# EAGLE design Project_Window_Control (EAGLE 9.0.0)
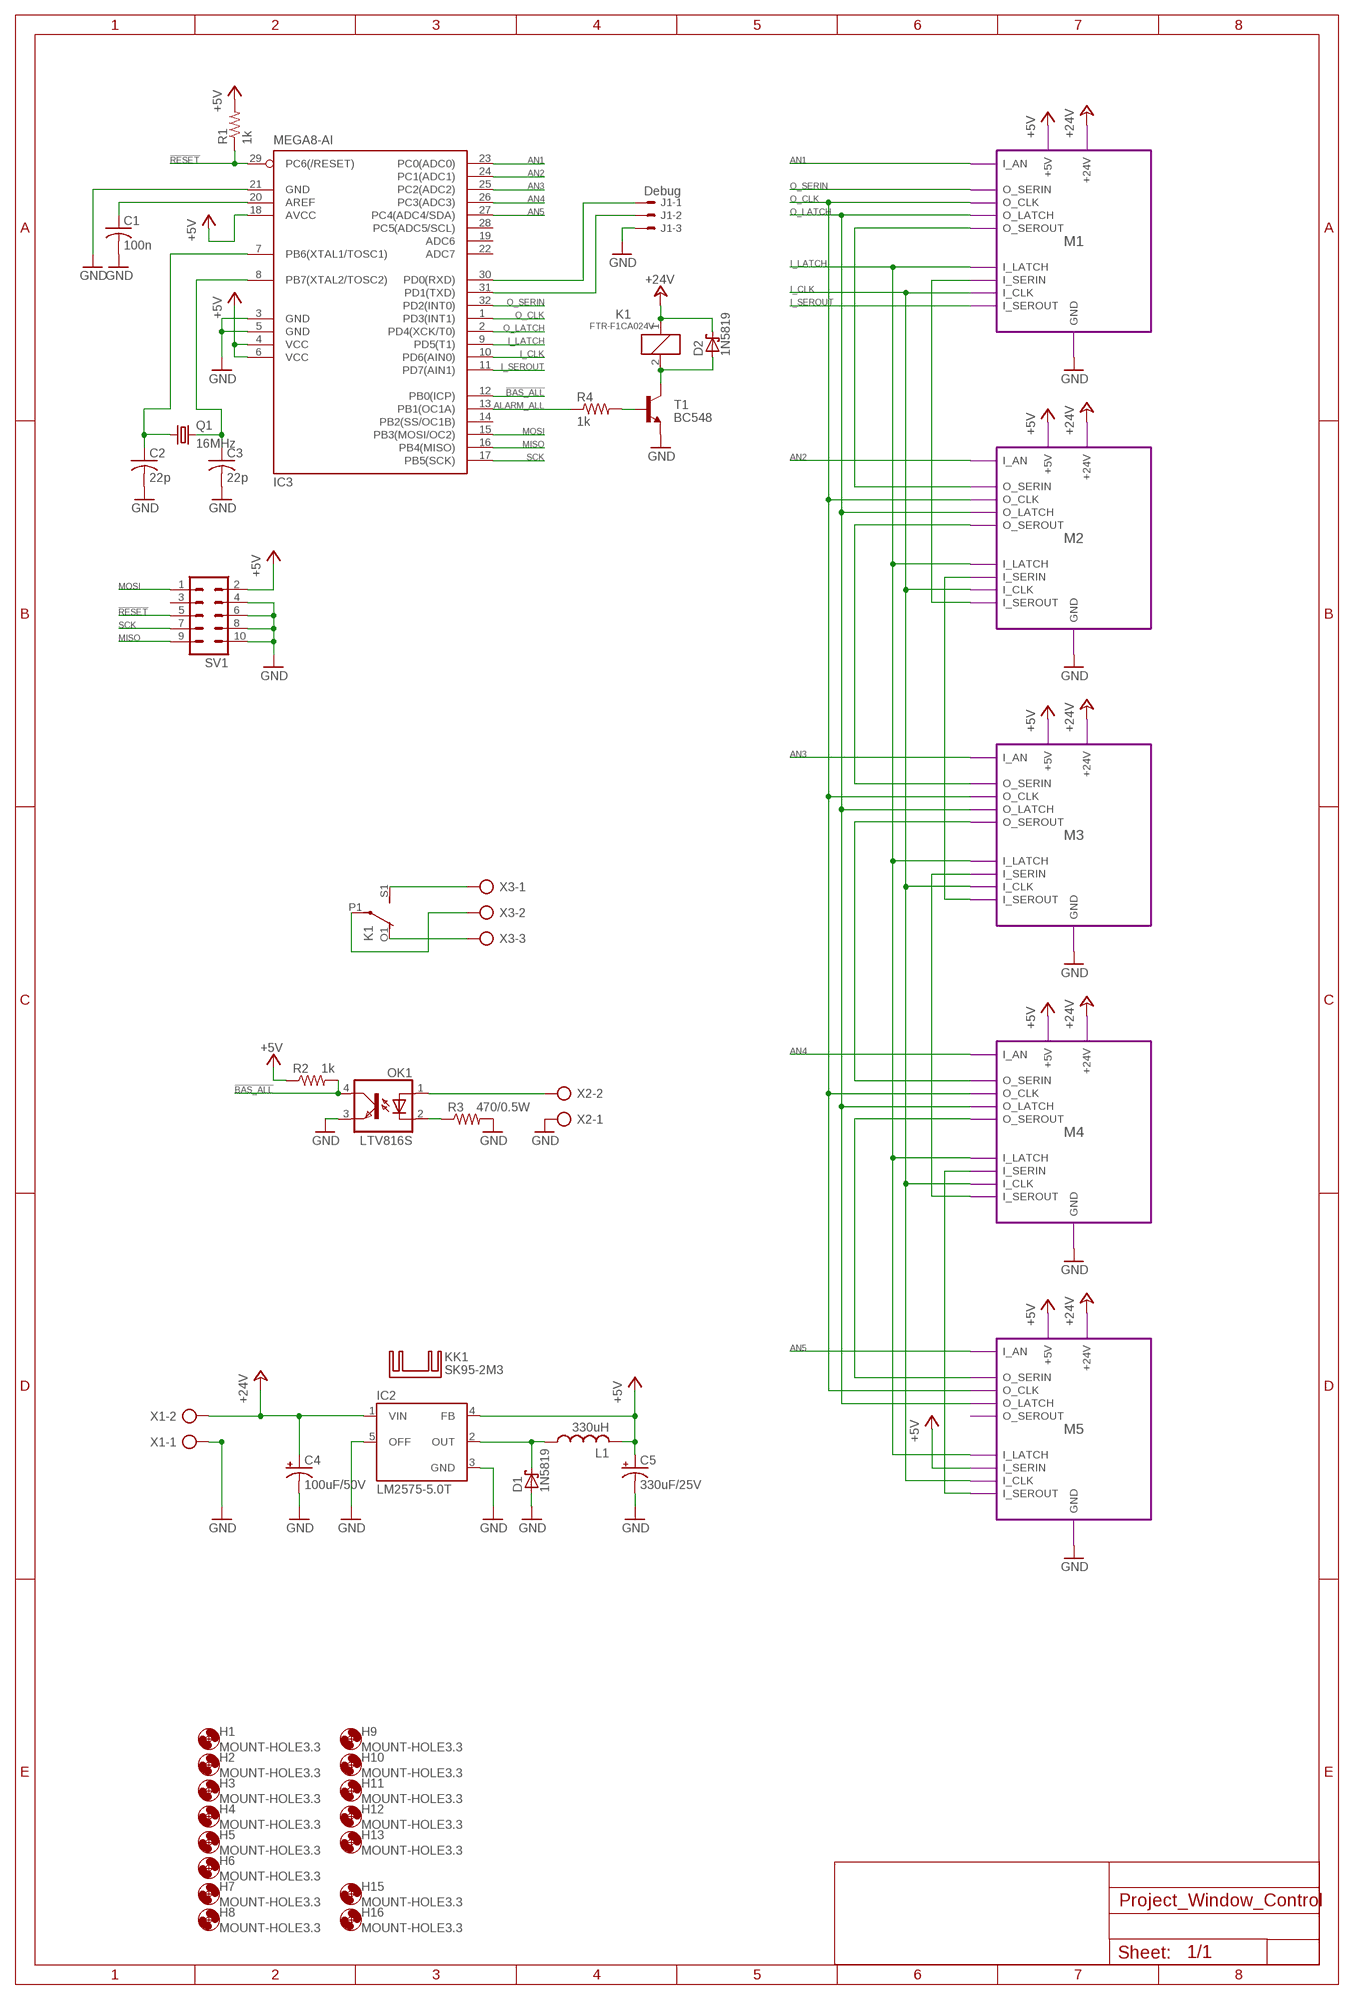
[diagram p0: schematic, sheet 1]

## Parts
C1  100n  C-US025_050-025X075  [C025_050-025X075]
C2  22p  C-US025-025X050  [C025-025X050]
C3  22p  C-US025-025X050  [C025-025X050]
C4  100uF/50V  CPOL-USE3.5-8  [E3,5-8]
C5  330uF/25V  CPOL-USE3.5-8  [E3,5-8]
D1  1N5819  SCHOTTKY-DIODEDO35-7  [DO35-7]
D2  1N5819  SCHOTTKY-DIODEDO35-7  [DO35-7]
H1  MOUNT-HOLE3.3  [3,3]
H2  MOUNT-HOLE3.3  [3,3]
H3  MOUNT-HOLE3.3  [3,3]
H4  MOUNT-HOLE3.3  [3,3]
H5  MOUNT-HOLE3.3  [3,3]
H6  MOUNT-HOLE3.3  [3,3]
H7  MOUNT-HOLE3.3  [3,3]
H8  MOUNT-HOLE3.3  [3,3]
H9  MOUNT-HOLE3.3  [3,3]
H10  MOUNT-HOLE3.3  [3,3]
H11  MOUNT-HOLE3.3  [3,3]
H12  MOUNT-HOLE3.3  [3,3]
H13  MOUNT-HOLE3.3  [3,3]
H15  MOUNT-HOLE3.3  [3,3]
H16  MOUNT-HOLE3.3  [3,3]
IC2  LM2575-5.0T  [TO220-5]
IC3  MEGA8-AI  [TQFP32-08]
J1  Debug  22-27-2031-03  [6410-03]
K1  FTR-F1CA024V  G2R2  [G2R2]
KK1  SK95-2M3  [SK95-2M3]
L1  330uH  L-US6000-XXX-RC  [6000-XXXX-RC]
OK1  LTV816S  [SMD4]
Q1  16MHz  CRYSTALHC49U-V  [HC49U-V]
R1  1k  R-US_R0805  [R0805]
R2  1k  R-US_R0805  [R0805]
R3  470/0.5W  R-US_0309/10  [0309/10]
R4  1k  R-US_R0805  [R0805]
SV1  ML10  [ML10]
T1  BC548  [TO92-EBC]
X1  AK500/2  [AK500/2]
X2  AK500/2  [AK500/2]
X3  AK500/3  [AK500/3]

## Module instances
M1 = M_CONTROL
M2 = M_CONTROL
M3 = M_CONTROL
M4 = M_CONTROL
M5 = M_CONTROL

## Nets
!BAS_ALL: IC3.12(PB0(ICP)) OK1.4(COL) R2.2
!RESET: IC3.29(PC6(/RESET)) R1.1 SV1.5
+5V: C5.+ IC2.4(FB) IC3.4(VCC) IC3.6(VCC) IC3.18(AVCC) L1.2 R1.2 R2.1 SV1.2 ; port M2.+5V M1.+5V M3.+5V M4.+5V M5.+5V M5.I_SERIN
+24V: C4.+ D2.C IC2.1(VIN) K1.1 X1.2 ; port M2.+24V M1.+24V M3.+24V M4.+24V M5.+24V
ALARM_ALL: IC3.13(PB1(OC1A)) R4.1
AN1: IC3.23(PC0(ADC0)) ; port M1.I_AN
AN2: IC3.24(PC1(ADC1)) ; port M2.I_AN
AN3: IC3.25(PC2(ADC2)) ; port M3.I_AN
AN4: IC3.26(PC3(ADC3)) ; port M4.I_AN
AN5: IC3.27(PC4(ADC4/SDA)) ; port M5.I_AN
BAS_ALL: OK1.1(A) X2.2
GND: C1.2 C2.2 C3.2 C4.- C5.- D1.A IC2.3(GND) IC2.5(OFF) IC3.3(GND) IC3.5(GND) IC3.21(GND) J1.3 OK1.3(EMIT) R3.2 SV1.4 SV1.6 SV1.8 SV1.10 T1.E X1.1 X2.1 ; port M1.GND M2.GND M3.GND M4.GND M5.GND
I_CLK: IC3.10(PD6(AIN0)) ; port M2.I_CLK M1.I_CLK M3.I_CLK M4.I_CLK M5.I_CLK
I_LATCH: IC3.9(PD5(T1)) ; port M1.I_LATCH M2.I_LATCH M3.I_LATCH M4.I_LATCH M5.I_LATCH
I_SEROUT: IC3.11(PD7(AIN1)) ; port M1.I_SEROUT
MISO: IC3.16(PB4(MISO)) SV1.9
MOSI: IC3.15(PB3(MOSI/OC2)) SV1.1
N$1: D2.A K1.2 T1.C
N$2: IC3.30(PD0(RXD)) J1.1
N$3: D1.C IC2.2(OUT) L1.1
N$4: R4.2 T1.B
N$5: OK1.2(C) R3.1
N$6: IC3.31(PD1(TXD)) J1.2
N$7: port M5.I_SEROUT M4.I_SERIN
N$8: port M1.O_SEROUT M2.O_SERIN
N$9: C3.1 IC3.8(PB7(XTAL2/TOSC2)) Q1.2
N$10: C2.1 IC3.7(PB6(XTAL1/TOSC1)) Q1.1
N$11: C1.1 IC3.20(AREF)
N$12: port M4.I_SEROUT M3.I_SERIN
N$13: port M3.I_SEROUT M2.I_SERIN
N$14: port M3.O_SERIN M2.O_SEROUT
N$15: port M2.I_SEROUT M1.I_SERIN
N$18: K1.S1(2:S) X3.1
N$20: port M4.O_SERIN M3.O_SEROUT
N$26: port M5.O_SERIN M4.O_SEROUT
N$40: K1.O1(2:O) X3.3
N$46: K1.P1(2:P) X3.2
O_CLK: IC3.1(PD3(INT1)) ; port M1.O_CLK M2.O_CLK M3.O_CLK M4.O_CLK M5.O_CLK
O_LATCH: IC3.2(PD4(XCK/T0)) ; port M1.O_LATCH M2.O_LATCH M3.O_LATCH M4.O_LATCH M5.O_LATCH
O_SERIN: IC3.32(PD2(INT0)) ; port M1.O_SERIN
SCK: IC3.17(PB5(SCK)) SV1.7
Unconnected: IC3.14(PB2(SS/OC1B)) IC3.19(ADC6) IC3.22(ADC7) IC3.28(PC5(ADC5/SCL)) K1.O2(3:O) K1.P2(3:P) K1.S2(3:S) SV1.3

## Library data of the parts
C1-C3 = rcl:C-US: CAPACITOR, American symbol
C4 C5 = rcl:CPOL-US: POLARIZED CAPACITOR, American symbol
D1 D2 = diode:SCHOTTKY-DIODE: Schottky Diode
H1-H13 H15 H16 = holes:MOUNT-HOLE: MOUNTING HOLE with drill center marker
IC2 = lm2575:LM2575-5.0: National Semiconductor <http://www.national.com> 1.0A "Simple Switcher"(c) 52kHz, Vout 1.23-37V (HV: 57V), Vin 40V (HV: 60V), 50µA standby current
IC3 = atmel:MEGA8: MICROCONTROLLER 8 Kbytes FLASH, 1 kbytes SRAM, 512 bytes EEPROM, USART, 6-channel 10 bit ADC, 2-channel 8 bit ADC Pin compatible with Atmega48, ATMega88, ATMega168 Source: avr.lbr; MPN: ATMEGA8-16AU; OC_FARNELL: 9171371; OC_NEWARK: 73M8863
J1 = con-molex:22-?-03: CONNECTOR wire to board 2.54 mm (.1 inch) pitch header; OC_FARNELL: unknown; OC_NEWARK: unknown
K1 = relay:G2R2: RELAY 2 x switch, Omron; MF: OMRON COMPONENTS USA; MPN: G2R-2-DC6; OC_FARNELL: unknown; OC_NEWARK: 89C5317
KK1 = heatsink:SK95-2M3: HEATSINK manufacturer Fischer/distributor Buerklin
L1 = rcl:L-US: INDUCTOR, American symbol
OK1 = optocoupler:LTV816: OPTO COUPLER Source: LITEON, LTV816.pdf; OC_FARNELL: unknown; OC_NEWARK: unknown
Q1 = crystal:CRYSTAL: CRYSTAL; OC_FARNELL: 1666969; OC_NEWARK: unknown
R1-R4 = rcl:R-US_: RESISTOR, American symbol
SV1 = con-ml:ML10: HARTING; OC_FARNELL: unknown; OC_NEWARK: unknown
T1 = transistor-npn:BC548*: NPN Transistor
X1 X2 = con-ptr500:AK500/2: CONNECTOR; OC_FARNELL: unknown; OC_NEWARK: unknown
X3 = con-ptr500:AK500/3: CONNECTOR; OC_FARNELL: unknown; OC_NEWARK: unknown

## Module M_CONTROL
Ports: I_AN(out) O_SERIN(in) O_CLK(in) O_LATCH(in) O_SEROUT(out) I_LATCH(in) I_SERIN(in) I_CLK(in) I_SEROUT(out) +5V(pwr) +24V(pwr) GND(pwr)
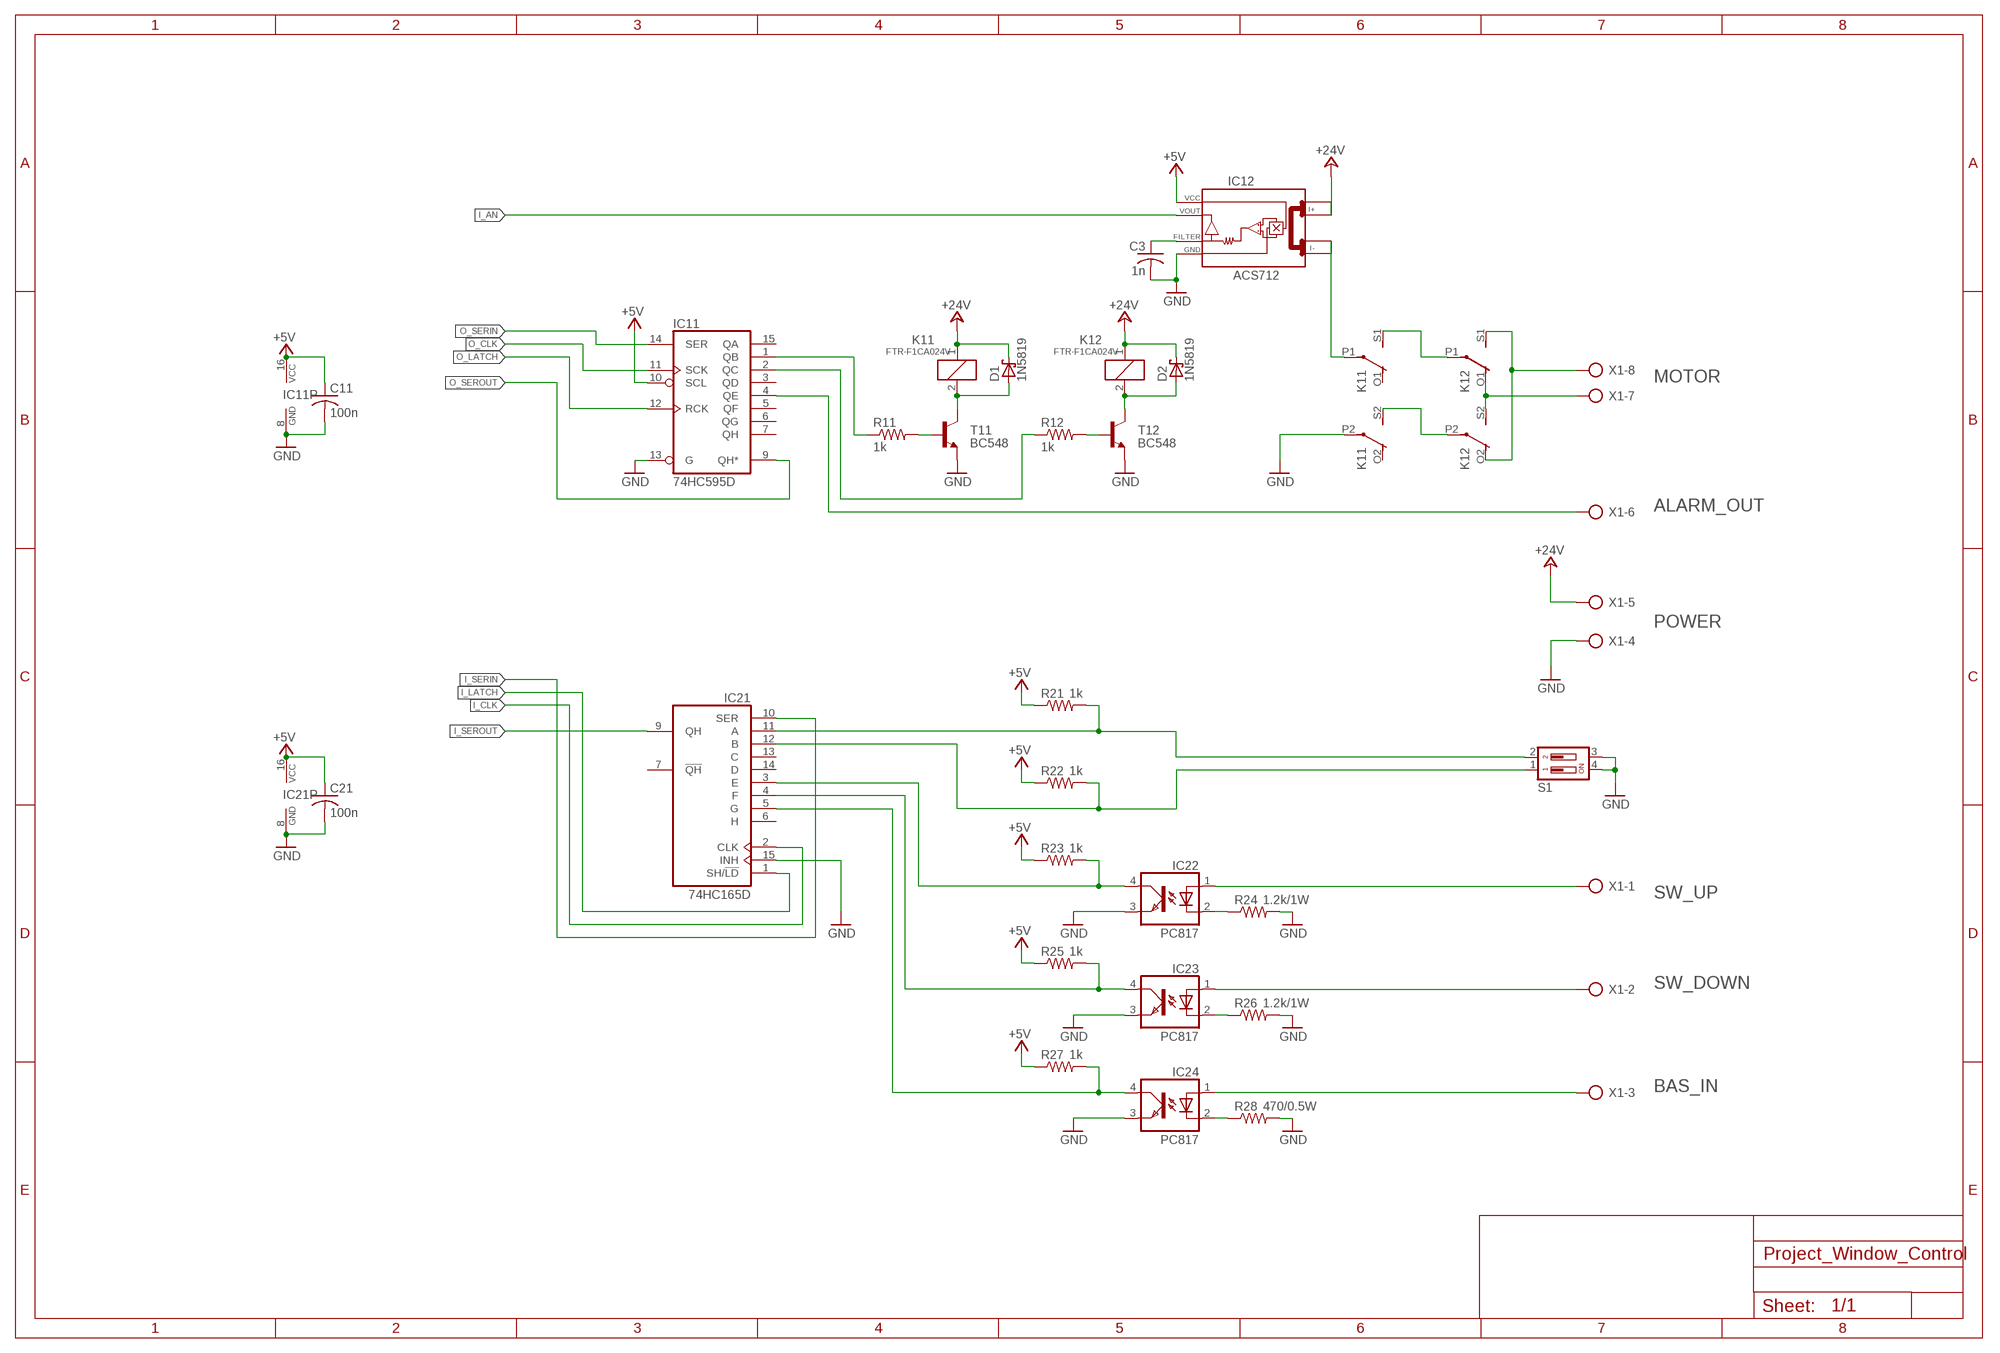
[diagram p1: schematic, module M_CONTROL, sheet 1]

### Parts
C3  1n  C-US025_050-025X075  [C025_050-025X075]
C11  100n  C-US025_050-025X075  [C025_050-025X075]
C21  100n  C-US025_050-025X075  [C025_050-025X075]
D1  1N5819  SCHOTTKY-DIODEDO35-7  [DO35-7]
D2  1N5819  SCHOTTKY-DIODEDO35-7  [DO35-7]
IC11  74HC595D  [SO16]
IC12  ACS712  [SO08]
IC21  74HC165D  [SO16]
IC22  PC817  LTV816S  [SMD4]
IC23  PC817  LTV816S  [SMD4]
IC24  PC817  LTV816S  [SMD4]
K11  FTR-F1CA024V  G2R2  [G2R2]
K12  FTR-F1CA024V  G2R2  [G2R2]
R11  1k  R-US_R0805  [R0805]
R12  1k  R-US_R0805  [R0805]
R21  1k  R-US_R0805  [R0805]
R22  1k  R-US_R0805  [R0805]
R23  1k  R-US_R0805  [R0805]
R24  1.2k/1W  R-US_0309/10  [0309/10]
R25  1k  R-US_R0805  [R0805]
R26  1.2k/1W  R-US_0309/10  [0309/10]
R27  1k  R-US_R0805  [R0805]
R28  470/0.5W  R-US_0309/10  [0309/10]
S1  DS02  [DS-02]
T11  BC548  [TO92-EBC]
T12  BC548  [TO92-EBC]
X1  AK500/8  [AK500/8]

### Nets
+5V: C11.1 C21.1 IC11.10(SCL) IC11.16(VCC) IC12.8(VCC) IC21.16(VCC) R21.1 R22.1 R23.1 R25.1 R27.1
+24V: D1.C D2.C IC12.1(I+_0) IC12.2(I+_1) K11.1 K12.1 X1.5
ALARM: IC11.4(QE) X1.6
BAS: IC24.1(A) X1.3
GND: C3.2 C11.2 C21.2 IC11.8(GND) IC11.13(G) IC12.5(GND) IC21.8(GND) IC21.15(INH) IC22.3(EMIT) IC23.3(EMIT) IC24.3(EMIT) K11.P2(3:P) R24.2 R26.2 R28.2 S1.3 S1.4 T11.E T12.E X1.4
I_AN: IC12.7(VOUT)
I_CLK: IC21.2(CLK)
I_LATCH: IC21.1(SH/!LD)
I_SERIN: IC21.10(SER)
I_SEROUT: IC21.9(QH)
MOTOR_A: K12.O2(3:O) K12.S1(2:S) X1.8
MOTOR_B: K12.O1(2:O) K12.S2(3:S) X1.7
N$1: K11.S1(2:S) K12.P1(2:P)
N$2: K11.S2(3:S) K12.P2(3:P)
N$3: D1.A K11.2 T11.C
N$4: R11.2 T11.B
N$5: IC22.2(C) R24.1
N$6: IC12.3(I-_0) IC12.4(I-_1) K11.P1(2:P)
N$7: D2.A K12.2 T12.C
N$8: R12.2 T12.B
N$9: C3.1 IC12.6(FILTER)
N$10: IC21.5(G) IC24.4(COL) R27.2
N$11: IC21.3(E) IC22.4(COL) R23.2
N$12: IC11.1(QB) R11.1
N$13: IC11.2(QC) R12.1
N$15: IC21.4(F) IC23.4(COL) R25.2
N$16: IC23.2(C) R26.1
N$17: IC24.2(C) R28.1
O_CLK: IC11.11(SCK)
O_LATCH: IC11.12(RCK)
O_SERIN: IC11.14(SER)
O_SEROUT: IC11.9(QH*)
S_DOWN: IC23.1(A) X1.2
S_SETTING: IC21.11(A) R21.2 S1.2
S_SETTING1: IC21.12(B) R22.2 S1.1
S_UP: IC22.1(A) X1.1
Unconnected: IC11.3(QD) IC11.5(QF) IC11.6(QG) IC11.7(QH) IC11.15(QA) IC21.6(H) IC21.7(!QH) IC21.13(C) IC21.14(D) K11.O1(2:O) K11.O2(3:O)

### Notes on the sheet
- MOTOR
- ALARM_OUT
- POWER
- SW_UP
- SW_DOWN
- BAS_IN

### Library data of the parts
C3 C11 C21 = rcl:C-US: CAPACITOR, American symbol
D1 D2 = diode:SCHOTTKY-DIODE: Schottky Diode
IC11 = 74xx-eu:74*595: 8-bit SHIFT REGISTER, output latch
IC12 = ACS712:ACS712
IC21 = 74xx-eu:74*165: 8-bit parallel load SHIFT REGISTER
IC22-IC24 = optocoupler:LTV816: OPTO COUPLER Source: LITEON, LTV816.pdf; OC_FARNELL: unknown; OC_NEWARK: unknown
K11 K12 = relay:G2R2: RELAY 2 x switch, Omron; MF: OMRON COMPONENTS USA; MPN: G2R-2-DC6; OC_FARNELL: unknown; OC_NEWARK: 89C5317
R11 = rcl:R-US_: RESISTOR, American symbol; SPICEPREFIX: R
R12 R21-R28 = rcl:R-US_: RESISTOR, American symbol
S1 = switch-dil:DS02: DIL/CODE SWITCH; OC_FARNELL: 9472126; OC_NEWARK: unknown
T11 T12 = transistor-npn:BC548*: NPN Transistor
X1 = con-ptr500:AK500/8: CONNECTOR; OC_FARNELL: unknown; OC_NEWARK: unknown

## Board
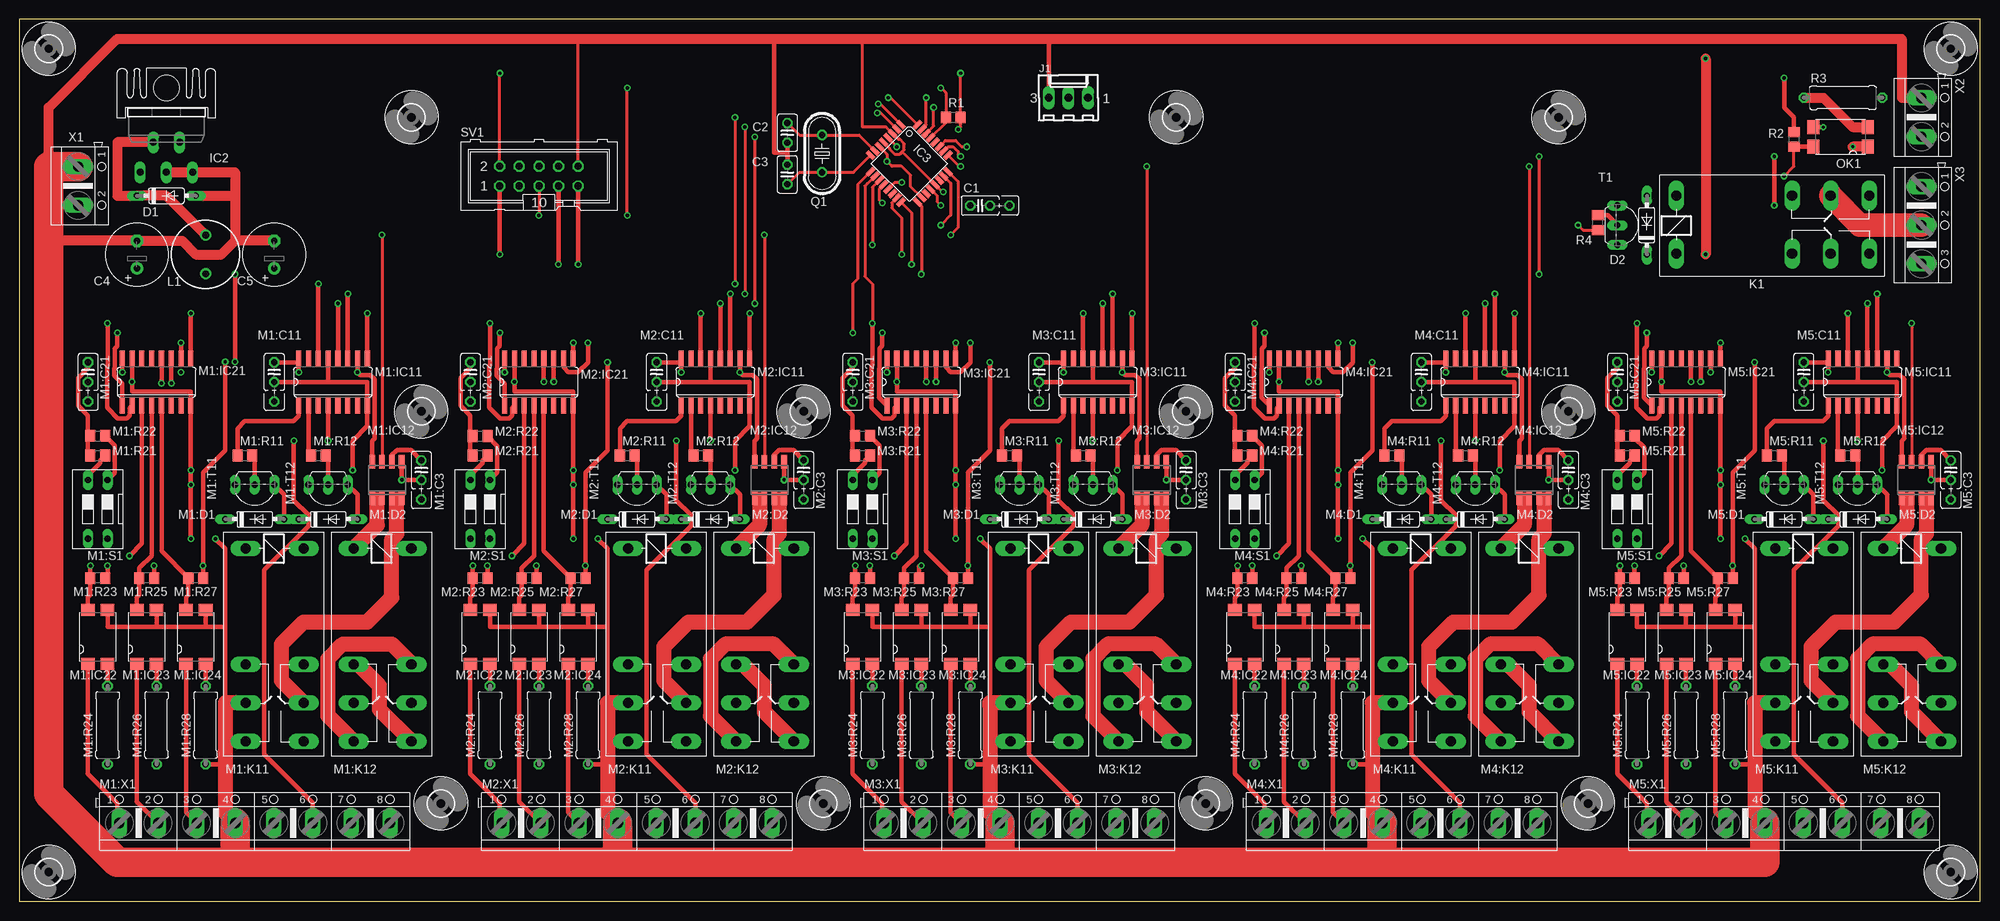
[diagram p2: board, top side]
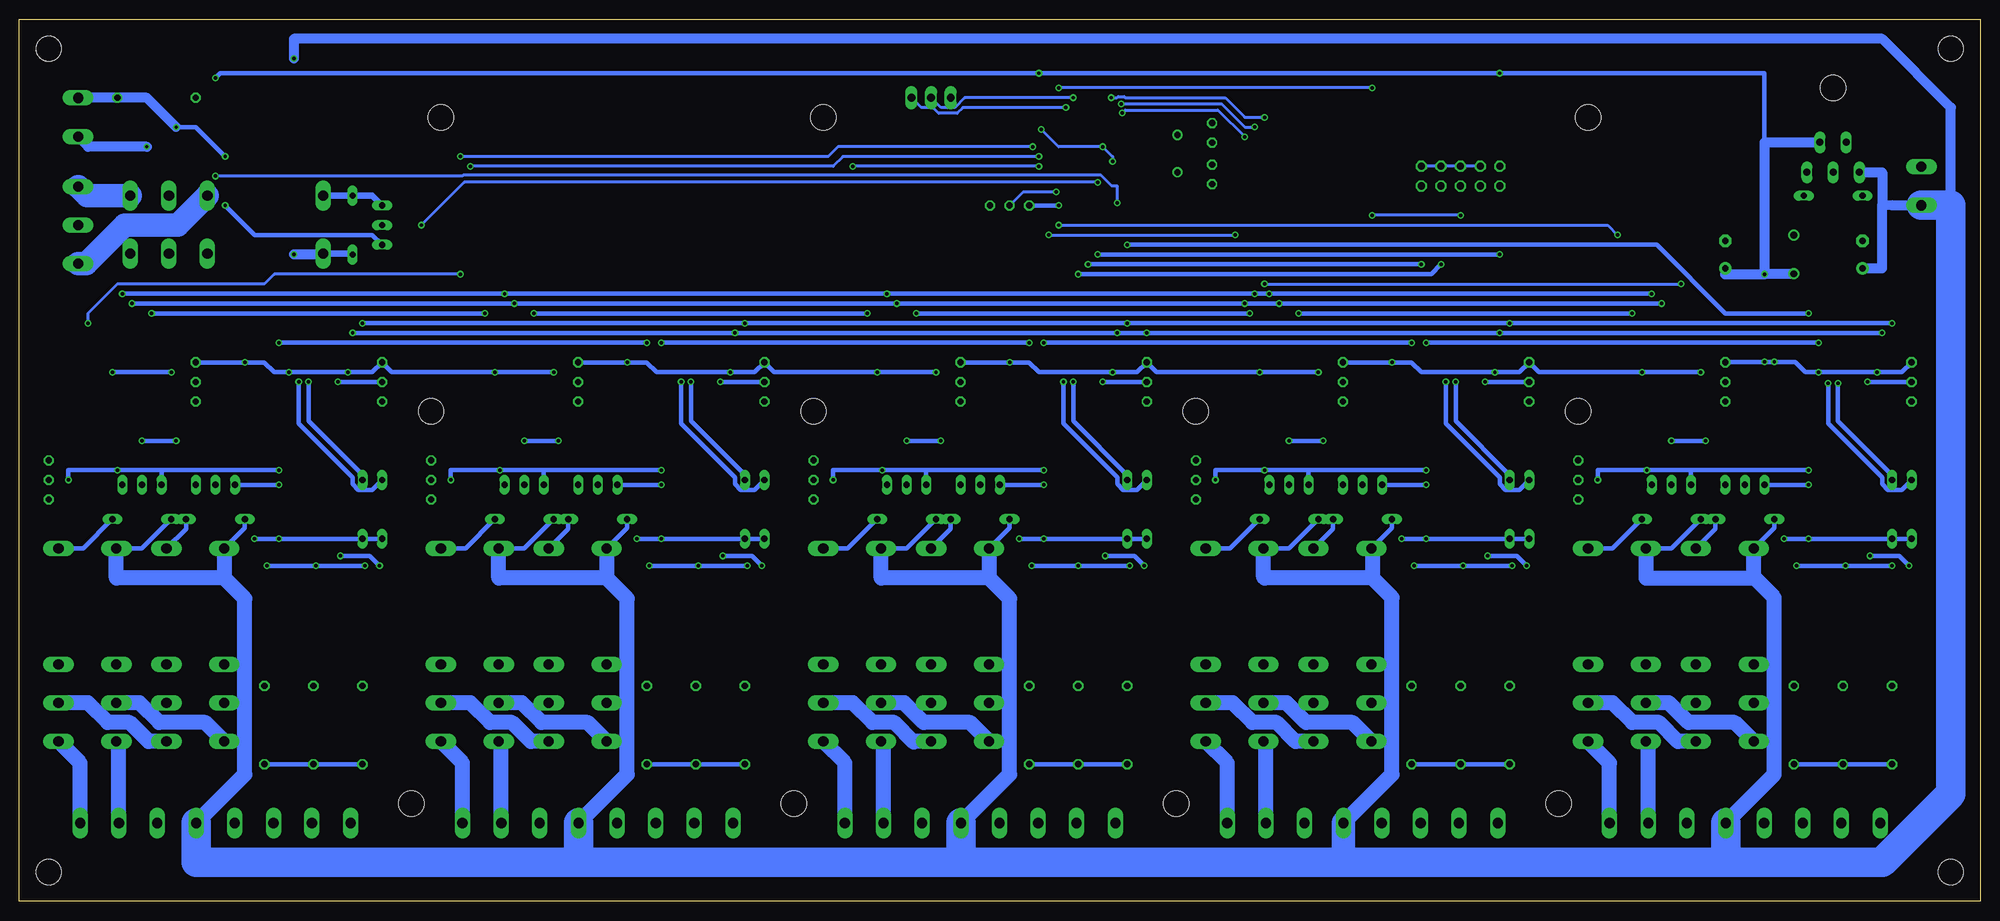
[diagram p3: board, bottom side, seen from below]

Size 254 x 114.3 mm. Coordinates in mm from the lower left corner, seen from the top.
Outline: 0,0 254,0 254,114.3 0,114.29 0,0
Copper layers (1*16): Top 0.035mm / dielectric 1.5mm / Bottom 0.035mm
Design rules "default *": minimum track width 6mil, minimum drill 0.35mm, track to track 12.5mil, track to pad 12.5mil, pad to pad 12.5mil, via to via 12.5mil, smd to smd 10mil, copper to edge 40mil, drill to drill 6mil, minimum pad ring 10mil, minimum via ring 8mil, stop-mask expansion 4mil, vias tented up to drill 0mil, thermal gap 10mil

### Footprints (pad centres in the part's own frame; a part is rotated, then mirrored left to right if it is on the bottom)
C025_050-025X075 = drill 0.813 octagon: 1 -1.27,0; 2 1.27,0; 3 3.81,0
C025-025X050 = drill 0.813 octagon: 1 -1.27,0; 2 1.27,0
E3,5-8 = drill 0.813 pad 1.6: + -1.778,0 | drill 0.813 pad 1.6 octagon: - 1.778,0
DO35-7 = drill 0.813 long: A 3.81,0; C -3.81,0
3,3 = hole 3.3: 0,0
TO220-5 = drill 0.9 long: 1 -3.4,-8.4; 2 -1.7,-4.5; 3 0,-8.4; 4 1.7,-4.5; 5 3.4,-8.4
TQFP32-08 = smd 1.27 x 0.559: 1 -4.293,2.8; 2 -4.293,2; 3 -4.293,1.2; 4 -4.293,0.4; 5 -4.293,-0.4; 6 -4.293,-1.2; 7 -4.293,-2; 8 -4.293,-2.8; 17 4.293,-2.8; 18 4.293,-2; 19 4.293,-1.2; 20 4.293,-0.4; 21 4.293,0.4; 22 4.293,1.2; 23 4.293,2; 24 4.293,2.8 | smd 0.559 x 1.27: 9 -2.8,-4.293; 10 -2,-4.293; 11 -1.2,-4.293; 12 -0.4,-4.293; 13 0.4,-4.293; 14 1.2,-4.293; 15 2,-4.293; 16 2.8,-4.293; 25 2.8,4.293; 26 2,4.293; 27 1.2,4.293; 28 0.4,4.293; 29 -0.4,4.293; 30 -1.2,4.293; 31 -2,4.293; 32 -2.8,4.293
6410-03 = drill 1.016 long: 1 2.54,0; 2 0,0; 3 -2.54,0
G2R2 = drill 1.321 long: 1 -2.54,-3.683; 2 -2.54,3.81; O1 12.471,3.81; O2 12.471,-3.683; P1 17.45,3.81; P2 17.45,-3.683; S1 22.454,3.81; S2 22.454,-3.683
SK95-2M3 = hole 3.302: 0,2.54
6000-XXXX-RC = drill 0.9 pad 1.422: 1 -2.5,0; 2 2.5,0
SO16 = smd 0.66 x 2.032: 1 -4.445,-3.073; 2 -3.175,-3.073; 3 -1.905,-3.073; 4 -0.635,-3.073; 5 0.635,-3.073; 6 1.905,-3.073; 7 3.175,-3.073; 8 4.445,-3.073; 9 4.445,3.073; 10 3.175,3.073; 11 1.905,3.073; 12 0.635,3.073; 13 -0.635,3.073; 14 -1.905,3.073; 15 -3.175,3.073; 16 -4.445,3.073
SO08 = smd 0.72 x 1.78: 1 -1.905,-2.35; 2 -0.635,-2.35; 3 0.635,-2.35; 4 1.905,-2.35; 5 1.905,2.35; 6 0.635,2.35; 7 -0.635,2.35; 8 -1.905,2.35
SMD4 = smd 1.78 x 1.55: 1 -1.27,-3.5; 2 1.27,-3.5; 3 1.27,3.5; 4 -1.27,3.5
R0805 = smd 1.3 x 1.5: 1 -0.95,0; 2 0.95,0
0309/10 = drill 0.813 octagon: 1 -5.08,0; 2 5.08,0
DS-02 = drill 0.813 long: 1 -1.27,-3.81; 2 1.27,-3.81; 3 1.27,3.81; 4 -1.27,3.81
TO92-EBC = drill 0.813 long: B 0,-1.27; C -2.54,-1.27; E 2.54,-1.27
AK500/8 = drill 1.321 long: 1 -17.526,0; 2 -12.497,0; 3 -7.518,0; 4 -2.489,0; 5 2.489,0; 6 7.518,0; 7 12.497,0; 8 17.526,0
HC49U-V = drill 0.813: 1 -2.413,0; 2 2.413,0
ML10 = drill 0.914 octagon: 1 -5.08,-1.27; 2 -5.08,1.27; 3 -2.54,-1.27; 4 -2.54,1.27; 5 0,-1.27; 6 0,1.27; 7 2.54,-1.27; 8 2.54,1.27; 9 5.08,-1.27; 10 5.08,1.27
AK500/2 = drill 1.321 long: 1 -2.515,0; 2 2.515,0
AK500/3 = drill 1.321 long: 1 -5.004,0; 2 0,0; 3 5.004,0

### Placement (x,y rotation side)
C1  124.46,90.17 0 top
C2  99.5,99.59 270 top
C3  99.5,94.2 90 top
C4  15.24,83.82 90 top
C5  33.02,83.82 90 top
D1  19.05,91.44 0 top
D2  210.82,87.63 90 top
H1  3.81,3.81 0 top
H2  250.19,3.81 0 top
H3  250.19,110.49 0 top
H4  3.81,110.49 0 top
H5  54.61,12.7 0 top
H6  104.14,12.7 0 top
H7  153.67,12.7 0 top
H8  203.2,12.7 0 top
H9  52.07,63.5 0 top
H10  101.6,63.5 0 top
H11  151.13,63.5 0 top
H12  200.66,63.5 0 top
H13  50.8,101.6 0 top
H15  149.86,101.6 0 top
H16  199.39,101.6 0 top
IC2  19.05,102.87 0 top
IC3  115.29,95.62 315 top
J1  135.89,104.14 0 top
K1  217.17,87.63 0 top
KK1  19.05,102.87 0 top
L1  24.13,83.82 270 top
M1:C3  1n  [C025_050-025X075]  52.07,55.88 270 top
M1:C11  100n  [C025_050-025X075]  33.02,68.58 270 top
M1:C21  100n  [C025_050-025X075]  8.89,68.58 270 top
M1:D1  1N5819  [DO35-7]  30.48,49.53 0 top
M1:D2  1N5819  [DO35-7]  40.01,49.53 0 top
M1:IC11  74HC595D  [SO16]  40.64,67.31 0 top
M1:IC12  ACS712  [SO08]  47.62,54.61 0 top
M1:IC21  74HC165D  [SO16]  17.78,67.31 0 top
M1:IC22  PC817  [SMD4]  10.16,34.29 0 top
M1:IC23  PC817  [SMD4]  16.51,34.29 0 top
M1:IC24  PC817  [SMD4]  22.86,34.29 0 top
M1:K11  FTR-F1CA024V  [G2R2]  33.02,43.18 270 top
M1:K12  FTR-F1CA024V  [G2R2]  46.99,43.18 270 top
M1:R11  1k  [R0805]  29.21,57.78 0 top
M1:R12  1k  [R0805]  38.73,57.78 0 top
M1:R21  1k  [R0805]  10.16,57.78 0 top
M1:R22  1k  [R0805]  10.16,60.33 0 top
M1:R23  1k  [R0805]  10.16,41.91 180 top
M1:R24  1.2k/1W  [0309/10]  11.43,22.86 270 top
M1:R25  1k  [R0805]  16.51,41.91 180 top
M1:R26  1.2k/1W  [0309/10]  17.78,22.86 270 top
M1:R27  1k  [R0805]  22.86,41.91 180 top
M1:R28  470/0.5W  [0309/10]  24.13,22.86 270 top
M1:S1  [DS-02]  10.16,50.8 180 top
M1:T11  BC548  [TO92-EBC]  30.48,52.7 180 top
M1:T12  BC548  [TO92-EBC]  40.01,52.7 180 top
M1:X1  [AK500/8]  30.48,10.16 0 top
M2:C3  1n  [C025_050-025X075]  101.6,55.88 270 top
M2:C11  100n  [C025_050-025X075]  82.55,68.58 270 top
M2:C21  100n  [C025_050-025X075]  58.42,68.58 270 top
M2:D1  1N5819  [DO35-7]  80.01,49.53 0 top
M2:D2  1N5819  [DO35-7]  89.53,49.53 0 top
M2:IC11  74HC595D  [SO16]  90.17,67.31 0 top
M2:IC12  ACS712  [SO08]  97.16,54.61 0 top
M2:IC21  74HC165D  [SO16]  67.31,67.31 0 top
M2:IC22  PC817  [SMD4]  59.69,34.28 0 top
M2:IC23  PC817  [SMD4]  66.04,34.29 0 top
M2:IC24  PC817  [SMD4]  72.39,34.29 0 top
M2:K11  FTR-F1CA024V  [G2R2]  82.55,43.18 270 top
M2:K12  FTR-F1CA024V  [G2R2]  96.52,43.18 270 top
M2:R11  1k  [R0805]  78.74,57.78 0 top
M2:R12  1k  [R0805]  88.27,57.78 0 top
M2:R21  1k  [R0805]  59.69,57.78 0 top
M2:R22  1k  [R0805]  59.69,60.3 0 top
M2:R23  1k  [R0805]  59.69,41.91 180 top
M2:R24  1.2k/1W  [0309/10]  60.96,22.86 270 top
M2:R25  1k  [R0805]  66.04,41.91 180 top
M2:R26  1.2k/1W  [0309/10]  67.31,22.86 270 top
M2:R27  1k  [R0805]  72.39,41.91 180 top
M2:R28  470/0.5W  [0309/10]  73.66,22.86 270 top
M2:S1  [DS-02]  59.69,50.8 180 top
M2:T11  BC548  [TO92-EBC]  80.01,52.7 180 top
M2:T12  BC548  [TO92-EBC]  89.53,52.7 180 top
M2:X1  [AK500/8]  80.01,10.16 0 top
M3:C3  1n  [C025_050-025X075]  151.13,55.88 270 top
M3:C11  100n  [C025_050-025X075]  132.08,68.58 270 top
M3:C21  100n  [C025_050-025X075]  107.95,68.58 270 top
M3:D1  1N5819  [DO35-7]  129.54,49.53 0 top
M3:D2  1N5819  [DO35-7]  139.06,49.53 0 top
M3:IC11  74HC595D  [SO16]  139.7,67.31 0 top
M3:IC12  ACS712  [SO08]  146.69,54.61 0 top
M3:IC21  74HC165D  [SO16]  116.84,67.31 0 top
M3:IC22  PC817  [SMD4]  109.22,34.29 0 top
M3:IC23  PC817  [SMD4]  115.57,34.29 0 top
M3:IC24  PC817  [SMD4]  121.92,34.29 0 top
M3:K11  FTR-F1CA024V  [G2R2]  132.08,43.18 270 top
M3:K12  FTR-F1CA024V  [G2R2]  146.05,43.18 270 top
M3:R11  1k  [R0805]  128.27,57.78 0 top
M3:R12  1k  [R0805]  137.79,57.78 0 top
M3:R21  1k  [R0805]  109.22,57.78 0 top
M3:R22  1k  [R0805]  109.22,60.33 0 top
M3:R23  1k  [R0805]  109.22,41.91 180 top
M3:R24  1.2k/1W  [0309/10]  110.49,22.86 270 top
M3:R25  1k  [R0805]  115.57,41.91 180 top
M3:R26  1.2k/1W  [0309/10]  116.84,22.86 270 top
M3:R27  1k  [R0805]  121.92,41.91 180 top
M3:R28  470/0.5W  [0309/10]  123.19,22.86 270 top
M3:S1  [DS-02]  109.22,50.8 180 top
M3:T11  BC548  [TO92-EBC]  129.54,52.7 180 top
M3:T12  BC548  [TO92-EBC]  139.06,52.7 180 top
M3:X1  [AK500/8]  129.54,10.16 0 top
M4:C3  1n  [C025_050-025X075]  200.66,55.88 270 top
M4:C11  100n  [C025_050-025X075]  181.61,68.58 270 top
M4:C21  100n  [C025_050-025X075]  157.48,68.58 270 top
M4:D1  1N5819  [DO35-7]  179.07,49.53 0 top
M4:D2  1N5819  [DO35-7]  188.59,49.53 0 top
M4:IC11  74HC595D  [SO16]  189.23,67.31 0 top
M4:IC12  ACS712  [SO08]  196.22,54.61 0 top
M4:IC21  74HC165D  [SO16]  166.37,67.31 0 top
M4:IC22  PC817  [SMD4]  158.75,34.29 0 top
M4:IC23  PC817  [SMD4]  165.1,34.29 0 top
M4:IC24  PC817  [SMD4]  171.45,34.29 0 top
M4:K11  FTR-F1CA024V  [G2R2]  181.61,43.18 270 top
M4:K12  FTR-F1CA024V  [G2R2]  195.58,43.18 270 top
M4:R11  1k  [R0805]  177.8,57.78 0 top
M4:R12  1k  [R0805]  187.32,57.78 0 top
M4:R21  1k  [R0805]  158.75,57.78 0 top
M4:R22  1k  [R0805]  158.75,60.33 0 top
M4:R23  1k  [R0805]  158.75,41.91 180 top
M4:R24  1.2k/1W  [0309/10]  160.02,22.86 270 top
M4:R25  1k  [R0805]  165.1,41.91 180 top
M4:R26  1.2k/1W  [0309/10]  166.37,22.86 270 top
M4:R27  1k  [R0805]  171.45,41.91 180 top
M4:R28  470/0.5W  [0309/10]  172.72,22.86 270 top
M4:S1  [DS-02]  158.75,50.8 180 top
M4:T11  BC548  [TO92-EBC]  179.07,52.7 180 top
M4:T12  BC548  [TO92-EBC]  188.59,52.7 180 top
M4:X1  [AK500/8]  179.07,10.16 0 top
M5:C3  1n  [C025_050-025X075]  250.19,55.88 270 top
M5:C11  100n  [C025_050-025X075]  231.14,68.58 270 top
M5:C21  100n  [C025_050-025X075]  207.01,68.58 270 top
M5:D1  1N5819  [DO35-7]  228.6,49.53 0 top
M5:D2  1N5819  [DO35-7]  238.12,49.53 0 top
M5:IC11  74HC595D  [SO16]  238.76,67.31 0 top
M5:IC12  ACS712  [SO08]  245.75,54.61 0 top
M5:IC21  74HC165D  [SO16]  215.9,67.31 0 top
M5:IC22  PC817  [SMD4]  208.28,34.29 0 top
M5:IC23  PC817  [SMD4]  214.63,34.29 0 top
M5:IC24  PC817  [SMD4]  220.98,34.29 0 top
M5:K11  FTR-F1CA024V  [G2R2]  231.14,43.18 270 top
M5:K12  FTR-F1CA024V  [G2R2]  245.11,43.18 270 top
M5:R11  1k  [R0805]  227.33,57.78 0 top
M5:R12  1k  [R0805]  236.85,57.78 0 top
M5:R21  1k  [R0805]  208.28,57.78 0 top
M5:R22  1k  [R0805]  208.28,60.33 0 top
M5:R23  1k  [R0805]  208.28,41.91 180 top
M5:R24  1.2k/1W  [0309/10]  209.55,22.86 270 top
M5:R25  1k  [R0805]  214.63,41.91 180 top
M5:R26  1.2k/1W  [0309/10]  215.9,22.86 270 top
M5:R27  1k  [R0805]  220.98,41.91 180 top
M5:R28  470/0.5W  [0309/10]  222.25,22.86 270 top
M5:S1  [DS-02]  208.28,50.8 180 top
M5:T11  BC548  [TO92-EBC]  228.6,52.7 180 top
M5:T12  BC548  [TO92-EBC]  238.12,52.7 180 top
M5:X1  [AK500/8]  228.6,10.16 0 top
OK1  235.91,99.06 90 top
Q1  103.99,96.89 270 top
R1  120.97,101.6 0 top
R2  229.87,98.74 270 top
R3  236.22,104.14 0 top
R4  204.47,87.95 90 top
SV1  67.31,93.98 0 top
T1  208.28,87.63 270 top
X1  7.62,92.71 270 top
X2  246.38,101.6 270 top
X3  246.38,87.63 270 top

### Tracks (layer width: path | path; a pad name or v marks a point on that pad's centre or on a via)
!BAS_ALL  (via drill 0.45)
  Top 0.406: IC3.12 111.44,92.34 111.44,90.81 v111.76,90.49 | v228.6,93.98 229.87,95.25 R2.2
  Top 0.61: R2.2 OK1.4
  Bottom 0.406: v111.76,90.49 111.76,92.71 112.48,92.71 113.91,94.14 196.45,94.14 196.6,93.98 v228.6,93.98
!RESET  (via drill 0.45)
  Top 0.406: SV1.5 v67.31,88.9 | v78.74,88.9 v78.74,105.41 | v119.38,105.41 120.02,104.77 R1.1 120.02,100.92 IC3.29
  Bottom 0.406: v78.74,105.41 v119.38,105.41 | v67.31,88.9 v78.74,88.9
+5V  (via drill 0.45)
  Top 0.406: IC3.4 113.67,97.81 v113.67,97.79 | IC3.6 112.39,96.82 v112.39,95.89 113.03,95.25 114.3,95.25 115.47,94.08 115.47,92.61 IC3.18 | SV1.2 v62.23,107.31 | v121.92,107.31 R1.2 121.92,100.65 121.92,100.33 v121.6,100.01
  Top 0.61: M1:R23.1 11.43,42.23 v11.43,43.5 | v17.46,43.5 M1:R25.1 | M1:R27.1 v23.81,43.49 v23.81,43.5 23.81,55.56 26.67,58.42 v26.67,69.91 | M1:IC11.10 v43.81,68.58 44.16,68.24 45.47,68.24 46.04,67.67 46.04,59.97 45.72,59.65 M1:IC12.8 | v36.2,68.58 M1:IC11.16 36.2,69.85 M1:C11.1 | M2:R27.1 v73.34,43.49 v73.34,43.5 73.34,55.56 76.2,58.42 v76.2,69.85 | v60.64,43.5 M2:R23.1 | M2:R25.1 v66.99,43.49 v66.99,43.5 | M3:R27.1 v122.87,43.49 v122.87,43.5 122.87,55.56 125.73,58.42 v125.73,69.85 | v110.17,43.5 v110.17,43.49 M3:R23.1 | M3:R25.1 116.52,43.5 v116.84,43.5 | M4:R27.1 v172.4,43.49 v172.4,43.5 172.4,55.56 175.26,58.42 v175.26,69.85 | v159.7,43.5 v159.7,43.49 M4:R23.1 | M4:R25.1 v166.05,43.49 v166.05,43.5 | M5:R27.1 v221.93,43.49 v221.93,43.5 221.93,55.56 224.79,58.42 v224.79,69.85 | v209.23,43.5 M5:R23.1 | M5:R25.1 v215.58,43.49 v215.58,43.5 | 62.87,70.48 M2:IC21.16 v62.87,68.58 | 85.72,70.48 M2:IC11.16 | 112.39,70.48 M3:IC21.16 v112.39,68.58 | 135.25,70.48 M3:IC11.16 | 161.93,70.48 M4:IC21.16 v161.93,68.58 | 184.78,70.48 M4:IC11.16 | 211.46,70.48 M5:IC21.16 v211.46,68.58 | 234.31,70.48 M5:IC11.16 | M2:R21.1 58.42,57.78 58.42,60.96 | M3:R21.1 107.95,57.78 107.95,59.69 | M1:R21.1 8.89,57.78 8.89,59.69 | M4:R21.1 157.48,57.78 157.48,59.69 | M5:R21.1 207.01,57.78 207.01,60.96 | M2:IC11.16 v85.72,68.58 | M2:IC11.10 v93.34,68.58 93.69,68.24 95,68.24 95.57,67.67 95.57,59.97 95.25,59.65 M2:IC12.8 | M3:IC11.16 v135.25,68.58 | M3:IC11.10 v142.88,68.58 143.22,68.24 144.53,68.24 145.1,67.67 145.1,59.97 144.78,59.65 M3:IC12.8 | M4:IC11.16 v184.78,68.58 | M4:IC11.10 v192.41,68.58 192.75,68.24 194.06,68.24 194.63,67.67 194.63,59.97 194.31,59.65 M4:IC12.8
  Top 0.61: M5:IC11.10 v241.94,68.58 242.28,68.24 243.59,68.24 244.16,67.67 244.16,59.97 243.84,59.65 M5:IC12.8 | M1:R22.1 9.21,60.01 8.89,59.69 | M2:R22.1 58.74,60.64 58.42,60.96 | M3:R22.1 108.27,60.01 107.95,59.69 | M4:R22.1 157.8,60.01 157.48,59.69 | M5:R22.1 207.33,60.64 207.01,60.96 | M1:C21.1 8.89,69.12 7.61,67.84 7.61,64.24 8.89,62.96 8.89,59.69 | M2:C21.1 58.42,69.12 57.14,67.84 57.14,64.24 58.42,62.96 58.42,60.96 | M3:C21.1 107.95,69.12 106.67,67.84 106.67,64.24 107.95,62.96 107.95,59.69 | M4:C21.1 157.48,69.12 156.2,67.84 156.2,64.24 157.48,62.96 157.48,59.69 | M5:C21.1 207.01,69.12 205.73,67.84 205.73,64.24 207.01,62.96 207.01,60.96 | M1:IC21.16 v13.34,68.58 | v27.94,81.28 v27.94,69.91 | v228.6,106.68 228.6,102.87 229.87,101.6 R2.1 | M5:IC21.10 v219.07,68.58 | M5:IC11.16 v234.31,68.58 | M5:C11.1 234.31,69.85 M5:IC11.16 | M4:C11.1 184.78,69.85 M4:IC11.16 | M3:C11.1 135.25,69.85 M3:IC11.16 | M2:C11.1 85.72,69.85 M2:IC11.16
  Bottom 0.406: v112.39,95.89 112.39,96.52 v113.67,97.79 119.38,97.79 v121.6,100.01
  Bottom 0.61: v11.43,43.5 v17.46,43.5 v23.81,43.5 | v36.2,68.58 v43.81,68.58 57.15,68.58 M2:C21.1 59.69,68.58 v62.87,68.58 72.39,68.58 73.66,69.85 v76.2,69.85 M2:C11.1 | M1:C11.1 33.02,69.91 v27.94,69.91 v26.67,69.91 23.98,69.91 22.65,68.58 v20.95,68.58 v13.34,68.58 10.16,68.58 M1:C21.1 | v73.34,43.5 v66.99,43.5 v60.64,43.5 | v122.87,43.5 v116.84,43.5 v110.17,43.5 | v172.4,43.5 v166.05,43.5 v159.7,43.5 | v221.93,43.5 v215.58,43.5 v209.23,43.5 | M3:C11.1 v125.73,69.85 123.19,69.85 121.92,68.58 v112.39,68.58 109.22,68.58 M3:C21.1 106.68,68.58 v93.34,68.58 v85.72,68.58 | M4:C11.1 v175.26,69.85 172.72,69.85 171.45,68.58 v161.93,68.58 158.75,68.58 M4:C21.1 156.21,68.58 v142.88,68.58 v135.25,68.58 | M5:C11.1 v224.79,69.85 222.25,69.85 220.98,68.58 v219.07,68.58 v211.46,68.58 208.28,68.58 M5:C21.1 205.74,68.58 v192.41,68.58 v184.78,68.58 | v234.31,68.58 v241.94,68.58 | 27.94,98.37 27.94,107.31 v62.23,107.31 v121.92,107.31 227.97,107.31 v228.6,106.68
  Bottom 1.27: IC2.4 27.94,98.37 v27.94,81.28 | v27.94,81.28 27.9,81.32 L1.2 | C5.+ 33.02,81.28 v27.94,81.28
+24V  (via drill 0.45)
  Top 0.61: M1:IC12.1 45.91,52.07 46.35,52.07 46.8,52.07 M1:IC12.2 | M2:IC12.1 95.69,52.26 95.89,52.07 96.08,52.26 M2:IC12.2 | M3:IC12.1 145.22,52.26 145.41,52.07 145.6,52.26 M3:IC12.2 | M4:IC12.1 194.75,52.26 194.94,52.07 195.13,52.26 M4:IC12.2 | M5:IC12.1 244.28,52.26 244.47,52.07 244.66,52.26 M5:IC12.2
  Top 1.27: v218.44,109.22 v218.44,83.82
  Top 1.93: M1:K12.1 46.35,48.77 46.35,52.07 | M2:K12.1 95.89,48.77 95.89,52.07 | M4:K12.1 194.94,48.77 194.94,52.07 | M5:K12.1 244.47,48.77 244.47,52.07 | M3:K12.1 145.41,48.77 145.41,52.07
  Bottom 0.61: M1:D2.C 40.01,45.72 M1:K12.1 | M1:K11.1 26.67,48.39 M1:D1.C | M2:K11.1 76.2,48.39 M2:D1.C | M2:D2.C 89.53,45.72 M2:K12.1 | M3:K11.1 125.73,48.39 M3:D1.C | M3:D2.C 139.06,45.72 M3:K12.1 | M4:K11.1 175.26,48.39 M4:D1.C | M4:D2.C 188.59,45.72 M4:K12.1 | M5:K11.1 224.79,48.39 M5:D1.C | M5:D2.C 238.12,45.72 M5:K12.1
  Bottom 0.813: K1.1 210.95,83.95 D2.C
  Bottom 1.27: 12.7,90.17 11.4,90.19 X1.2 3.81,90.19 3.81,102.87 12.7,111.76 218.44,111.76 v218.44,109.22 | IC2.1 12.7,94.47 12.7,90.17 | v218.44,83.82 214.63,83.82 K1.1 | C4.+ 12.7,82.04 12.7,90.17
  Bottom 1.93: 29.34,41.91 M1:K11.1 | M1:K12.1 43.31,41.91 29.34,41.91 | M1:X1.5 26.67,16.46 26.67,39.37 29.21,41.91 29.34,41.91 | M2:K11.1 78.74,45.59 78.74,41.91 | 78.74,41.91 92.71,41.91 92.84,42.04 M2:K12.1 | M3:K11.1 128.4,41.91 | M3:K12.1 142.37,41.91 128.4,41.91 | M4:K11.1 177.93,41.91 | M4:K12.1 191.9,41.91 177.93,41.91 | M5:K11.1 227.46,41.91 | M5:K12.1 241.43,41.91 227.46,41.91 | 78.74,41.91 76.2,39.37 76.2,16.46 M2:X1.5 | 128.4,41.91 125.73,39.24 125.73,16.46 M3:X1.5 | 177.93,41.91 175.26,39.24 175.26,16.46 M4:X1.5 | 227.46,41.91 224.79,39.24 224.79,16.46 M5:X1.5
  Bottom 3.048: M2:X1.5 82.5,5.08
  Bottom 3.81: 32.97,5.08 M1:X1.5 | M5:X1.5 231.09,5.08 181.56,5.08 | 181.56,5.08 132.03,5.08 | 132.03,5.08 82.5,5.08 32.97,5.08 | M4:X1.5 181.56,5.08 | M3:X1.5 132.03,5.08 | 32.97,5.08 12.7,5.08 3.81,13.97 3.81,90.17 3.83,90.19 X1.2
ALARM_ALL  (via drill 0.45)
  Top 0.406: 113.42,93.19 v114.3,93.19 | v201.93,87.63 202.56,87 R4.1 | IC3.13 113.42,93.19 | 113.42,93.19
  Bottom 0.406: v114.3,93.19 196.37,93.19 v201.93,87.63
AN1  (via drill 0.45)
  Top 0.406: 120.65,93.09 | 120.65,93.09 120.65,88.9 v119.38,87.63 | v46.99,86.36 M1:IC12.7 | IC3.23 120.65,93.09
  Bottom 0.406: v119.38,87.63 48.26,87.63 v46.99,86.36
AN2  (via drill 0.45)
  Top 0.406: IC3.24 121.6,93.27 121.6,87.31 v120.65,86.36 | v96.52,86.36 M2:IC12.7
  Bottom 0.406: v120.65,86.36 v96.52,86.36
AN3  (via drill 0.45)
  Top 0.406: v146.05,95.25 M3:IC12.7 | IC3.25 121.73,95.25 v121.92,95.25
  Bottom 0.406: v121.92,95.25 v146.05,95.25
AN4  (via drill 0.45)
  Top 0.406: IC3.26 120.28,97.79 120.97,97.79 121.6,97.16 121.6,96.68 121.76,96.52 v121.92,96.52 | v195.58,95.25 M4:IC12.7
  Bottom 0.406: v121.92,96.52 147.32,96.52 148.59,95.25 v195.58,95.25
AN5  (via drill 0.45)
  Top 0.406: 119.95,98.58 121.28,98.58 122.08,97.79 v122.71,97.79 | v196.85,96.52 v196.85,81.28 | v245.11,74.93 M5:IC12.7 | IC3.27 119.95,98.58 | 119.95,98.58
  Bottom 0.406: v122.71,97.79 147.96,97.79 149.22,96.52 v196.85,96.52 | v196.85,81.28 220.98,81.28 222.25,80.01 241.3,80.01 245.11,76.2 v245.11,74.93
BAS_ALL  (via drill 0.35)
  Top 1.27: OK1.1 v237.49,97.79
  Bottom 1.27: X2.2 245.09,97.79 v237.49,97.79
GND  (via drill 0.35, 0.45)
  Top 0.406: IC3.5 112.71,97.63 112.71,97.47 113.35,96.84 114.05,96.84 114.34,97.12 | 114.34,97.12 114.61,97.4 114.61,98.1 114.62,98.11 114.61,98.11 114.61,98.18 114.06,98.74 113.99,98.74 | 113.99,98.74 113.98,98.74 | 113.99,98.74 113.87,98.74 IC3.3 112.28,100.33 | 114.34,97.12 114.36,97.12 IC3.21 119.56,91.92 v119.7,91.92 | SV1.10 72.39,111.76 | 112.28,100.33 109.22,100.33 109.22,111.76 | 112.28,100.33
  Top 0.61: 26.67,35.56 26.67,25.73 | M1:IC24.3 24.13,35.56 | 24.13,35.56 26.67,35.56 | M1:IC22.3 11.43,35.56 17.78,35.56 | 17.78,35.56 24.13,35.56 | M1:IC23.3 17.78,35.56 | v22.23,46.99 v22.23,53.98 v22.23,55.88 M1:IC21.8 22.23,66.04 14.61,66.04 v14.61,67.31 M1:IC21.15 | M1:R28.2 26.67,17.78 | M1:C11.2 40.01,67.31 | 40.01,67.31 45.09,67.31 M1:IC11.8 45.09,61.59 43.18,59.69 v43.18,55.88 | M1:IC11.13 40.01,67.31 | M1:IC12.5 v49.53,54.61 M1:C3.2 | v25.4,46.99 26.67,45.72 26.67,35.56 | v74.93,46.99 76.2,45.72 76.2,35.56 | 76.2,35.56 76.2,25.73 | v223.52,46.99 224.79,45.72 224.79,35.56 | 224.79,35.56 224.79,25.73 | v173.99,46.99 175.26,45.72 175.26,35.56 | 175.26,35.56 175.26,25.73 | v124.46,46.99 125.73,45.72 125.73,35.56 | 125.73,35.56 125.73,25.4 | M2:IC22.3 60.96,35.56 67.31,35.56 | 67.31,35.56 73.66,35.56 | 73.66,35.56 76.2,35.56 | M2:IC23.3 67.31,35.56 | M2:IC24.3 73.66,35.56 | M3:IC22.3 110.49,35.56 116.84,35.56 | 116.84,35.56 123.19,35.56 | 123.19,35.56 125.73,35.56 | M3:IC23.3 116.84,35.56 | M3:IC24.3 123.19,35.56 | M4:IC22.3 160.02,35.56 166.37,35.56 | 166.37,35.56 172.72,35.56 | 172.72,35.56 175.26,35.56 | M4:IC23.3 166.37,35.56 | M4:IC24.3 172.72,35.56 | M5:IC22.3 209.55,35.56 215.9,35.56 | 215.9,35.56 222.25,35.56 | 222.25,35.56 224.79,35.56 | M5:IC23.3 215.9,35.56 | M5:IC24.3 222.25,35.56 | v71.75,46.99 v71.75,53.98 v71.75,55.88 M2:IC21.8 71.75,66.04 64.14,66.04 v64.14,67.31 M2:IC21.15 | v121.28,46.99 v121.28,53.98 v121.28,55.88 M3:IC21.8 121.28,66.04 113.67,66.04 v113.67,67.31 M3:IC21.15 | v170.81,46.99 v170.81,53.98 v170.81,55.88 M4:IC21.8 170.81,66.04 163.19,66.04 v163.19,67.31 M4:IC21.15 | v220.34,46.99 v220.34,53.98 v220.34,55.88 M5:IC21.8 220.34,66.04 212.72,66.04 v212.72,67.31 M5:IC21.15
  Top 0.61: M2:IC12.5 v99.06,54.61 M2:C3.2 | M3:IC12.5 v148.59,54.61 M3:C3.2 | M4:IC12.5 v198.12,54.61 M4:C3.2 | M5:IC12.5 v247.65,54.61 M5:C3.2 | 89.53,67.31 94.61,67.31 M2:IC11.8 94.61,61.59 92.71,59.69 v92.71,55.88 | 89.53,67.31 M2:C11.2 | 139.06,67.31 144.15,67.31 M3:IC11.8 144.15,61.59 142.24,59.69 v142.24,55.88 | 139.06,67.31 M3:C11.2 | 188.59,67.31 193.68,67.31 M4:IC11.8 193.68,61.59 191.77,59.69 v191.77,55.88 | 188.59,67.31 M4:C11.2 | 238.12,67.31 243.21,67.31 M5:IC11.8 243.21,61.59 241.3,59.69 v241.3,55.88 | 238.12,67.31 M5:C11.2 | M5:IC11.13 238.12,67.31 | M4:IC11.13 188.59,67.31 | M3:IC11.13 139.06,67.31 | M2:IC11.13 89.53,67.31 | M2:R28.2 76.2,17.78 | M3:R28.2 125.73,17.78 | M4:R28.2 175.26,17.78 | M5:R28.2 224.79,17.78 | v227.33,90.17 v227.33,96.52 | C2.2 99.5,97 | 97.79,111.76 97.79,97 99.5,97 | C3.2 99.5,97 | v233.68,100.33 OK1.3 | J1.3 133.35,111.76
  Top 1.27: 3.81,85.09 3.81,85.6 C4.- 21.08,85.6 22.86,83.82 26.16,83.82 27.94,85.6 | IC2.3 IC2.5 27.94,94.47 27.94,91.44 | 27.94,91.44 27.94,85.6 | D1.A 27.94,91.44 | C5.- 27.94,85.6 | 3.81,95.22 3.81,102.87 12.7,111.76 72.39,111.76 97.79,111.76 109.22,111.76 133.35,111.76 243.84,111.76 243.87,104.11 X2.1
  Top 1.93: M1:X1.4 26.67,11.48 26.67,17.78 26.67,25.73 M1:K11.P2 | M2:X1.4 76.2,11.48 76.2,17.78 76.2,25.73 M2:K11.P2 | M3:X1.4 125.73,11.48 125.73,17.78 125.73,25.4 125.73,25.73 M3:K11.P2 | M4:X1.4 175.26,11.48 175.26,17.78 175.26,25.73 M4:K11.P2 | M5:X1.4 224.79,11.48 224.79,17.78 224.79,25.73 M5:K11.P2
  Top 3.81: M1:X1.4 27.99,5.08 | M5:X1.4 226.11,5.08 176.53,5.08 | 176.53,5.08 127,5.08 | 127,5.08 77.47,5.08 | 77.47,5.08 27.99,5.08 | M2:X1.4 77.47,10.16 77.47,5.08 | M3:X1.4 127,10.16 127,5.08 | M4:X1.4 176.53,10.16 176.53,5.08 | X1.1 3.81,95.22 3.81,85.09 3.81,13.97 12.7,5.08 27.99,5.08
  Bottom 0.406: v119.7,91.92 123.98,91.92 C1.2 | SV1.4 SV1.6 SV1.8 SV1.10
  Bottom 0.61: M1:R28.2 M1:R26.2 M1:R24.2 | M1:T11.E v22.23,53.98 | M1:T12.E 37.47,55.88 | 37.47,55.88 v22.23,55.88 | 37.47,55.88 v43.18,55.88 49.53,55.88 v49.53,54.61 | M1:C21.2 v14.61,67.31 | M1:S1.3 M1:S1.4 v22.23,46.99 v25.4,46.99 | M2:R24.2 M2:R26.2 M2:R28.2 | M2:S1.3 M2:S1.4 v71.75,46.99 v74.93,46.99 | M3:S1.3 M3:S1.4 v121.28,46.99 v124.46,46.99 | M3:R24.2 M3:R26.2 M3:R28.2 | M4:R24.2 M4:R26.2 M4:R28.2 | M4:S1.3 M4:S1.4 v170.81,46.99 v173.99,46.99 | M5:R24.2 M5:R26.2 | 217.17,17.78 M5:R26.2 | M5:R26.2 M5:R28.2 | M5:S1.3 M5:S1.4 v220.34,46.99 v223.52,46.99 | M2:C21.2 v64.14,67.31 | M3:C21.2 v113.67,67.31 | M4:C21.2 v163.19,67.31 | M5:C21.2 v212.72,67.31 | M2:T11.E v71.75,53.98 | M3:T11.E v121.28,53.98 | M4:T11.E v170.81,53.98 | M5:T11.E v220.34,53.98 | v99.06,54.61 99.06,55.88 v92.71,55.88 87,55.88 | 87,55.88 v71.75,55.88 | v148.59,54.61 148.59,55.88 v142.24,55.88 136.53,55.88 | 136.53,55.88 v121.28,55.88 | v198.12,54.61 198.12,55.88 v191.77,55.88 186.06,55.88 | 186.06,55.88 v170.81,55.88 | v247.65,54.61 247.65,55.88 v241.3,55.88 235.59,55.88 | 235.59,55.88 v220.34,55.88 | M2:T12.E 87,55.88 | M3:T12.E 136.53,55.88 | M4:T12.E 186.06,55.88 | M5:T12.E 235.59,55.88 | T1.E 208.28,86.36 223.52,86.36 v227.33,90.17 | v227.33,96.52 231.14,100.33 v233.68,100.33
  Bottom 1.27: X2.1 241.32,104.11 R3.2 237.49,104.14 v233.68,100.33
I_CLK  (via drill 0.45)
  Top 0.406: IC3.10 109.86,93.02 109.54,92.7 109.54,80.96 110.49,80.01 v110.49,74.93
  Top 0.61: M1:IC21.2 14.29,63.92 14.29,62.96 13.92,62.6 12.75,62.6 11.36,63.99 11.36,69.4 11.43,69.47 v11.43,74.93 | M2:IC21.2 63.82,63.92 63.82,62.96 63.45,62.6 62.28,62.6 60.89,63.99 60.89,69.4 60.96,69.47 v60.96,74.93 | M3:IC21.2 113.35,63.92 113.35,62.96 112.98,62.6 111.81,62.6 110.42,63.99 110.42,69.4 110.49,69.47 v110.49,74.93 | M4:IC21.2 162.88,63.92 162.88,62.96 162.51,62.6 161.34,62.6 159.95,63.99 159.95,69.4 160.02,69.47 v160.02,74.93 | M5:IC21.2 212.41,63.92 212.41,62.96 212.04,62.6 210.87,62.6 209.48,63.99 209.48,69.4 209.55,69.47 v209.55,74.93
  Bottom 0.61: v11.43,74.93 v60.96,74.93 v110.49,74.93 v160.02,74.93 v209.55,74.93
I_LATCH  (via drill 0.45)
  Top 0.406: IC3.9 108.58,92.88 108.58,80.64 107.95,80.01 v107.95,73.66
  Top 0.61: M1:IC21.1 13.34,67.09 12.28,68.14 12.28,69.02 12.36,69.09 12.36,71.63 12.7,71.97 v12.7,73.66 | v111.76,73.66 111.76,71.97 111.42,71.63 111.42,69.09 111.34,69.02 111.34,65.29 M3:IC21.1 | v210.82,73.66 210.82,71.97 210.48,71.63 210.48,69.09 210.41,69.02 210.41,65.29 M5:IC21.1 | M2:IC21.1 62.87,67.09 61.81,68.14 61.81,69.02 61.91,69.11 61.91,71.66 62.23,71.97 v62.23,73.66 | v161.29,73.66 161.29,71.97 160.97,71.66 160.97,69.11 160.88,69.02 160.88,65.29 M4:IC21.1
  Bottom 0.61: v12.7,73.66 v62.23,73.66 v107.95,73.66 v111.76,73.66 v161.29,73.66 v210.82,73.66
I_SEROUT  (via drill 0.45)
  Top 0.406: IC3.11 110.49,92.52 v110.49,85.09
  Top 0.61: M1:IC21.9 v22.23,76.2
  Bottom 0.61: v110.49,85.09 41.91,85.09 33.02,76.2 v22.23,76.2
M1:ALARM  (via drill 0.45)
  Top 0.61: M1:X1.6 38,12.8 31.75,19.05 31.75,42.92 37.48,48.65 37.48,50.06 35.56,51.98 v35.56,59.69 | v40.01,59.69 M1:IC11.4
  Bottom 0.61: v35.56,59.69 v40.01,59.69
M1:BAS
  Top 0.61: M1:X1.3 21.59,11.53 M1:IC24.1
M1:MOTOR_A
  Top 1.93: M1:K12.S1 46.67,24.85 46.67,27.94 43.9,30.71 M1:K12.O2
  Bottom 1.93: M1:X1.8 48.01,17.93 M1:K12.S1
M1:MOTOR_B
  Top 1.93: M1:K12.S2 40.01,24.03 40.01,31.43 41.91,33.34 48.26,33.34 50.8,30.8 M1:K12.O1
  Bottom 1.93: M1:X1.7 42.98,20.4 M1:K12.S2
M1:N$1
  Bottom 1.93: M1:K11.S1 39.14,20.73 41.59,23.18 45.09,23.18 47.64,25.73 M1:K12.P1
M1:N$2
  Bottom 1.93: M1:K11.S2 31.79,23.18 37.78,23.18 40.34,25.73 M1:K12.P2
M1:N$3
  Top 0.61: M1:T11.C 34.29,52.7 M1:D1.A
  Bottom 0.61: M1:K11.2 34.29,48.26 M1:D1.A
M1:N$4
  Top 0.61: M1:T11.B 30.48,57.47 M1:R11.2
M1:N$5
  Top 0.61: M1:R24.1 M1:IC22.2
M1:N$6
  Top 0.61: M1:IC12.3 48.45,52.07 48.9,52.07 49.34,52.07 M1:IC12.4
  Top 1.93: M1:K11.P1 33.97,28.59 33.97,33.34 36.83,36.2 45.09,36.2 48.26,39.37 48.26,46.99 48.9,47.62 48.9,52.07
M1:N$7
  Top 0.61: M1:D2.A 43.81,52.7 M1:T12.C
  Bottom 0.61: M1:D2.A 47.62,45.72 M1:K12.2
M1:N$8
  Top 0.61: M1:T12.B 40.01,57.47 M1:R12.2
M1:N$9
  Top 0.61: M1:C3.1 50.75,58.47 48.91,58.47 48.26,57.82 M1:IC12.6
M1:N$10
  Top 0.61: M1:IC21.5 18.41,45.41 M1:R27.2 21.91,39.69 21.59,39.37 M1:IC24.4
M1:N$11  (via drill 0.45)
  Top 0.61: M1:IC21.3 15.88,46.35 v14.29,44.77 | v9.21,43.5 M1:R23.2 9.21,39.69 8.89,39.37 M1:IC22.4
  Bottom 0.61: v14.29,44.77 10.48,44.77 v9.21,43.5
M1:N$12
  Top 0.61: M1:IC11.1 36.2,62.87 35.56,62.23 29.21,62.23 28.26,61.28 M1:R11.1
M1:N$13
  Top 0.61: M1:IC11.2 37.47,58.1 M1:R12.1
M1:N$15
  Top 0.61: M1:IC21.4 17.14,44.77 15.56,43.18 M1:R25.2 | M1:R25.2 | M1:R25.2 15.56,39.69 15.24,39.37 M1:IC23.4
M1:N$16
  Top 0.61: M1:R26.1 M1:IC23.2
M1:N$17
  Top 0.61: M1:R28.1 M1:IC24.2
M1:S_DOWN
  Top 0.406: 15.24,30.48 M1:IC23.1
  Top 0.61: M1:X1.2 15.24,12.9 15.24,30.48
M1:S_SETTING  (via drill 0.45)
  Top 0.61: M1:IC21.11 v19.68,67.15 | M1:R21.2 10.48,57.16 10.48,56.78 8.89,55.19 M1:S1.2
  Bottom 0.61: M1:S1.2 10.16,53.34 10.89,53.34 10.9,53.33 11.96,53.33 12.71,54.08 12.71,54.94 19.68,61.91 v19.68,67.15
M1:S_SETTING1  (via drill 0.45)
  Top 0.61: v18.41,67.15 M1:IC21.12 | M1:S1.1 11.43,54.55 12.38,55.51 12.38,59.05 M1:R22.2
  Bottom 0.61: v18.41,67.15 18.41,62.27 11.43,55.29 M1:S1.1
M1:S_UP
  Top 0.406: M1:IC22.1 8.89,30.48
  Top 0.61: 8.89,30.48 8.89,16.51 12.7,12.7 12.7,10.16 M1:X1.1
M2:ALARM  (via drill 0.45)
  Top 0.61: M2:IC11.4 v89.53,59.69 | M2:X1.6 87.63,10.16 87.63,12.7 81.28,19.05 81.28,42.92 87.01,48.65 87.01,50.06 85.09,51.98 v85.09,59.69
  Bottom 0.61: v89.53,59.69 v85.09,59.69
M2:BAS
  Top 0.61: M2:X1.3 71.12,11.53 M2:IC24.1
M2:MOTOR_A
  Top 1.93: M2:K12.S1 96.52,24.54 96.52,27.94 93.75,30.71 M2:K12.O2
  Bottom 1.93: M2:X1.8 97.54,17.93 M2:K12.S1
M2:MOTOR_B
  Top 1.93: M2:K12.S2 89.53,24.03 89.53,31.43 91.44,33.34 97.7,33.34 M2:K12.O1
  Bottom 1.93: M2:X1.7 92.51,20.4 M2:K12.S2
M2:N$1
  Bottom 1.93: M2:K11.S1 88.67,20.73 91.12,23.18 94.3,23.18 96.85,25.73 M2:K12.P1
M2:N$2
  Bottom 1.93: M2:K11.S2 81.32,23.18 87.31,23.18 89.86,25.73 M2:K12.P2
M2:N$3
  Top 0.61: M2:T11.C 83.82,52.7 M2:D1.A
  Bottom 0.61: M2:K11.2 83.82,48.26 M2:D1.A
M2:N$4
  Top 0.61: M2:R11.2 80.01,57.78 M2:T11.B
M2:N$5
  Top 0.61: M2:IC22.2 M2:R24.1
M2:N$6
  Top 0.61: M2:IC12.3 98.23,52.26 | 98.23,52.26 98.42,52.07 | M2:IC12.4 98.23,52.26
  Top 1.93: M2:K11.P1 83.5,28.59 83.5,33.02 86.68,36.2 94.3,36.2 97.79,39.69 97.79,46.99 98.42,47.62 98.42,52.07
M2:N$7
  Top 0.61: M2:T12.C 93.34,52.7 M2:D2.A
  Bottom 0.61: M2:D2.A 97.16,45.72 M2:K12.2
M2:N$8
  Top 0.61: M2:R12.2 89.53,57.78 M2:T12.B
M2:N$9
  Top 0.61: M2:C3.1 100.28,58.47 98.44,58.47 97.79,57.82 M2:IC12.6
M2:N$10
  Top 0.61: M2:IC24.4 71.12,39.37 71.44,39.69 M2:R27.2 67.94,45.41 M2:IC21.5
M2:N$11  (via drill 0.45)
  Top 0.61: M2:IC22.4 58.42,39.37 58.74,39.69 M2:R23.2 v58.74,43.49 v58.74,43.5 | v63.82,44.77 65.41,46.35 M2:IC21.3
  Bottom 0.61: v58.74,43.5 60.01,44.77 v63.82,44.77
M2:N$12
  Top 0.61: M2:IC11.1 85.72,62.87 85.09,62.23 78.74,62.23 77.79,61.28 M2:R11.1
M2:N$13
  Top 0.61: M2:IC11.2 87,58.1 M2:R12.1
M2:N$15
  Top 0.61: M2:IC23.4 64.77,39.37 65.09,39.69 M2:R25.2 65.09,43.18 66.67,44.77 M2:IC21.4
M2:N$16
  Top 0.61: M2:IC23.2 M2:R26.1
M2:N$17
  Top 0.61: M2:IC24.2 M2:R28.1
M2:S_DOWN
  Top 0.61: M2:X1.2 64.77,12.9 M2:IC23.1
M2:S_SETTING  (via drill 0.45)
  Top 0.61: M2:IC21.11 v69.22,67.31 | M2:R21.2 60.01,57.16 60.01,56.78 58.42,55.19 M2:S1.2
  Bottom 0.61: v69.22,67.31 69.22,61.91 62.24,54.94 62.24,54.08 61.49,53.33 59.7,53.33 M2:S1.2
M2:S_SETTING1  (via drill 0.45)
  Top 0.61: M2:IC21.12 v67.94,67.31 | M2:R22.2 61.91,59.03 61.91,57.15 61.91,56.78 61.91,55.56 M2:S1.1
  Bottom 0.61: v67.94,67.31 67.94,62.23 60.96,55.24 M2:S1.1
M2:S_UP
  Top 0.61: M2:IC22.1 58.42,16.51 62.23,12.7 62.23,10.16 M2:X1.1
M3:ALARM  (via drill 0.45)
  Top 0.61: M3:IC11.4 v139.06,59.69 | M3:X1.6 137.06,12.8 130.81,19.05 130.81,42.92 136.54,48.65 136.54,50.06 134.62,51.98 v134.62,59.69
  Bottom 0.61: v139.06,59.69 v134.62,59.69
M3:BAS
  Top 0.61: M3:X1.3 120.65,11.53 M3:IC24.1
M3:MOTOR_A
  Top 1.93: M3:K12.S1 146.05,24.54 146.05,27.94 143.28,30.71 M3:K12.O2
  Bottom 1.93: M3:X1.8 147.07,17.93 M3:K12.S1
M3:MOTOR_B
  Top 1.93: M3:K12.S2 139.06,24.03 139.06,31.43 140.97,33.34 147.23,33.34 M3:K12.O1
  Bottom 1.93: M3:X1.7 142.04,20.12 142.24,20.32 142.24,20.6 M3:K12.S2
M3:N$1
  Bottom 1.93: M3:K11.S1 138.02,20.73 138.11,20.64 140.65,23.18 143.51,23.18 146.06,25.73 M3:K12.P1
M3:N$2
  Bottom 1.93: M3:K11.S2 130.85,23.18 136.84,23.18 139.4,25.73 M3:K12.P2
M3:N$3
  Top 0.61: M3:T11.C 133.35,52.7 M3:D1.A
  Bottom 0.61: M3:K11.2 133.35,48.26 M3:D1.A
M3:N$4
  Top 0.61: M3:R11.2 129.54,57.78 M3:T11.B
M3:N$5
  Top 0.61: M3:IC22.2 M3:R24.1
M3:N$6
  Top 0.61: M3:IC12.3 147.76,52.26 147.96,52.07 148.15,52.26 M3:IC12.4
  Top 1.93: M3:K11.P1 133.03,28.59 133.03,33.02 136.21,36.2 143.83,36.2 147.32,39.69 147.32,46.99 147.96,47.62 147.96,52.07
M3:N$7
  Top 0.61: M3:T12.C 142.88,52.7 M3:D2.A
  Bottom 0.61: M3:D2.A 146.69,45.72 M3:K12.2
M3:N$8
  Top 0.61: M3:R12.2 139.06,57.78 M3:T12.B
M3:N$9
  Top 0.61: M3:C3.1 149.81,58.47 147.97,58.47 147.32,57.82 M3:IC12.6
M3:N$10
  Top 0.61: M3:IC24.4 120.65,39.37 120.97,39.69 M3:R27.2 117.47,45.41 M3:IC21.5
M3:N$11  (via drill 0.45)
  Top 0.61: M3:IC22.4 107.95,39.37 108.27,39.69 M3:R23.2 v108.27,43.49 v108.27,43.5 | v113.35,44.77 114.94,46.35 M3:IC21.3
  Bottom 0.61: v108.27,43.5 109.54,44.77 v113.35,44.77
M3:N$12
  Top 0.61: M3:IC11.1 135.25,62.87 134.62,62.23 128.27,62.23 127.32,61.28 M3:R11.1
M3:N$13
  Top 0.61: M3:IC11.2 136.53,58.1 M3:R12.1
M3:N$15
  Top 0.61: M3:IC23.4 114.3,39.37 114.62,39.69 M3:R25.2 114.62,43.18 116.2,44.77 M3:IC21.4
M3:N$16
  Top 0.61: M3:IC23.2 M3:R26.1
M3:N$17
  Top 0.61: M3:IC24.2 M3:R28.1
M3:S_DOWN
  Top 0.61: M3:X1.2 114.3,12.9 M3:IC23.1
M3:S_SETTING  (via drill 0.45)
  Top 0.61: M3:IC21.11 v118.75,67.31 | M3:R21.2 109.54,57.16 109.54,56.78 107.95,55.19 M3:S1.2
  Bottom 0.61: v118.75,67.31 118.75,61.91 111.77,54.94 111.77,54.08 111.02,53.33 109.23,53.33 M3:S1.2
M3:S_SETTING1  (via drill 0.45)
  Top 0.61: M3:IC21.12 v117.47,67.31 | M3:S1.1 110.49,54.55 111.44,55.51 111.44,59.05 M3:R22.2
  Bottom 0.61: v117.47,67.31 117.47,62.23 110.49,55.24 M3:S1.1
M3:S_UP
  Top 0.61: M3:IC22.1 107.95,16.51 111.76,12.7 111.76,10.16 M3:X1.1
M4:ALARM  (via drill 0.45)
  Top 0.61: M4:IC11.4 v188.59,59.69 | M4:X1.6 186.59,12.8 180.34,19.05 180.34,42.92 186.07,48.65 186.07,50.06 184.15,51.98 v184.15,59.69
  Bottom 0.61: v188.59,59.69 v184.15,59.69
M4:BAS
  Top 0.61: M4:X1.3 170.18,11.53 M4:IC24.1
M4:MOTOR_A
  Top 1.93: M4:K12.S1 195.58,24.54 195.58,27.94 192.81,30.71 M4:K12.O2
  Bottom 1.93: M4:X1.8 196.6,17.93 M4:K12.S1
M4:MOTOR_B
  Top 1.93: M4:K12.S2 188.59,24.03 188.59,31.43 190.5,33.34 196.76,33.34 M4:K12.O1
  Bottom 1.93: M4:X1.7 191.57,20.4 M4:K12.S2
M4:N$1
  Bottom 1.93: M4:K11.S1 187.73,20.73 190.18,23.18 193.04,23.18 195.59,25.73 M4:K12.P1
M4:N$2
  Bottom 1.93: M4:K11.S2 180.38,23.18 186.37,23.18 188.93,25.73 M4:K12.P2
M4:N$3
  Top 0.61: M4:T11.C 182.88,52.7 M4:D1.A
  Bottom 0.61: M4:K11.2 182.88,48.26 M4:D1.A
M4:N$4
  Top 0.61: M4:R11.2 179.07,57.78 M4:T11.B
M4:N$5
  Top 0.61: M4:IC22.2 M4:R24.1
M4:N$6
  Top 0.61: M4:IC12.3 197.29,52.26 | 197.29,52.26 197.49,52.07 | M4:IC12.4 197.29,52.26
  Top 1.93: M4:K11.P1 182.56,28.59 182.56,33.02 185.74,36.2 193.36,36.2 196.85,39.69 196.85,46.99 197.49,47.62 197.49,52.07
M4:N$7
  Top 0.61: M4:T12.C 192.41,52.7 M4:D2.A
  Bottom 0.61: M4:D2.A 196.22,45.72 M4:K12.2
M4:N$8
  Top 0.61: M4:R12.2 188.59,57.78 M4:T12.B
M4:N$9
  Top 0.61: M4:C3.1 199.34,58.47 197.5,58.47 196.85,57.82 M4:IC12.6
M4:N$10
  Top 0.61: M4:IC24.4 170.18,39.37 170.5,39.69 M4:R27.2 167,45.41 M4:IC21.5
M4:N$11  (via drill 0.45)
  Top 0.61: M4:IC22.4 157.48,39.37 157.8,39.69 M4:R23.2 v157.8,43.49 v157.8,43.5 | v162.88,44.77 164.47,46.35 M4:IC21.3
  Bottom 0.61: v157.8,43.5 159.07,44.77 v162.88,44.77
M4:N$12
  Top 0.61: M4:IC11.1 184.78,62.87 184.15,62.23 177.8,62.23 176.85,61.28 M4:R11.1
M4:N$13
  Top 0.61: M4:IC11.2 186.06,58.1 M4:R12.1
M4:N$15
  Top 0.61: M4:IC23.4 163.83,39.37 164.15,39.69 M4:R25.2 164.15,43.18 165.74,44.77 M4:IC21.4
M4:N$16
  Top 0.61: M4:IC23.2 M4:R26.1
M4:N$17
  Top 0.61: M4:IC24.2 M4:R28.1
M4:S_DOWN
  Top 0.61: M4:X1.2 163.83,12.9 M4:IC23.1
M4:S_SETTING  (via drill 0.45)
  Top 0.61: M4:IC21.11 v168.28,67.31 | M4:R21.2 159.07,57.16 159.07,56.78 157.48,55.19 M4:S1.2
  Bottom 0.61: v168.28,67.31 168.28,61.91 161.3,54.94 161.3,54.08 160.55,53.33 158.76,53.33 M4:S1.2
M4:S_SETTING1  (via drill 0.45)
  Top 0.61: M4:IC21.12 v167,67.31 | M4:S1.1 160.02,54.55 160.97,55.51 160.97,59.05 M4:R22.2
  Bottom 0.61: v167,67.31 167,62.23 160.02,55.24 M4:S1.1
M4:S_UP
  Top 0.61: M4:IC22.1 157.48,16.51 161.29,12.7 161.29,10.16 M4:X1.1
M5:ALARM  (via drill 0.45)
  Top 0.61: M5:IC11.4 v238.12,59.69 | M5:X1.6 236.12,12.8 229.87,19.05 229.87,42.92 235.6,48.65 235.6,50.06 233.68,51.98 v233.68,59.69
  Bottom 0.61: v238.12,59.69 v233.68,59.69
M5:BAS
  Top 0.61: M5:X1.3 219.71,11.53 M5:IC24.1
M5:MOTOR_A
  Top 1.93: M5:K12.S1 245.11,24.54 245.11,27.94 242.34,30.71 M5:K12.O2
  Bottom 1.93: M5:X1.8 246.13,17.93 M5:K12.S1
M5:MOTOR_B
  Top 1.93: M5:K12.S2 238.12,24.03 238.12,31.43 240.03,33.34 246.29,33.34 M5:K12.O1
  Bottom 1.93: M5:X1.7 241.1,20.4 M5:K12.S2
M5:N$1
  Bottom 1.93: M5:K11.S1 237.26,20.73 239.71,23.18 242.57,23.18 245.12,25.73 M5:K12.P1
M5:N$2
  Bottom 1.93: M5:K11.S2 229.91,23.18 235.9,23.18 238.46,25.73 M5:K12.P2
M5:N$3
  Top 0.61: M5:T11.C 232.41,52.7 M5:D1.A
  Bottom 0.61: M5:K11.2 232.41,48.26 M5:D1.A
M5:N$4
  Top 0.61: M5:R11.2 228.6,57.78 M5:T11.B
M5:N$5
  Top 0.61: M5:IC22.2 M5:R24.1
M5:N$6
  Top 0.61: M5:IC12.3 246.82,52.26 | 246.82,52.26 247.01,52.07 | M5:IC12.4 246.82,52.26
  Top 1.93: M5:K11.P1 232.09,28.59 232.09,33.02 235.27,36.2 242.89,36.2 246.38,39.69 246.38,46.99 247.01,47.62 247.01,52.07
M5:N$7
  Top 0.61: M5:T12.C 241.94,52.7 M5:D2.A
  Bottom 0.61: M5:D2.A 245.75,45.72 M5:K12.2
M5:N$8
  Top 0.61: M5:R12.2 238.12,57.78 M5:T12.B
M5:N$9
  Top 0.61: M5:C3.1 248.87,58.47 247.03,58.47 246.38,57.82 M5:IC12.6
M5:N$10
  Top 0.61: M5:IC24.4 219.71,39.37 220.03,39.69 M5:R27.2 216.53,45.41 M5:IC21.5
M5:N$11  (via drill 0.45)
  Top 0.61: M5:IC22.4 207.01,39.37 207.33,39.69 M5:R23.2 v207.33,43.49 v207.33,43.5 | v212.41,44.77 214,46.35 M5:IC21.3
  Bottom 0.61: v207.33,43.5 208.6,44.77 v212.41,44.77
M5:N$12
  Top 0.61: M5:IC11.1 234.31,62.87 233.68,62.23 227.33,62.23 226.38,61.28 M5:R11.1
M5:N$13
  Top 0.61: M5:IC11.2 235.59,58.1 M5:R12.1
M5:N$15
  Top 0.61: M5:IC23.4 213.36,39.37 213.68,39.69 M5:R25.2 213.68,43.18 215.26,44.77 M5:IC21.4
M5:N$16
  Top 0.61: M5:IC23.2 M5:R26.1
M5:N$17
  Top 0.61: M5:IC24.2 M5:R28.1
M5:S_DOWN
  Top 0.61: M5:X1.2 213.36,12.9 M5:IC23.1
M5:S_SETTING  (via drill 0.45)
  Top 0.61: M5:IC21.11 v217.81,67.31 | M5:R21.2 208.6,57.16 208.6,56.78 207.01,55.19 M5:S1.2
  Bottom 0.61: v217.81,67.31 217.81,61.91 210.83,54.94 210.83,54.08 210.08,53.33 208.29,53.33 M5:S1.2
M5:S_SETTING1  (via drill 0.45)
  Top 0.61: M5:IC21.12 v216.53,67.31 | M5:R22.2 209.23,60.06 210.5,58.79 210.5,55.51 209.55,54.55 M5:S1.1
  Bottom 0.61: v216.53,67.31 216.53,62.23 209.55,55.24 M5:S1.1
M5:S_UP
  Top 0.61: M5:IC22.1 207.01,16.51 210.82,12.7 210.82,10.16 M5:X1.1
MISO  (via drill 0.45)
  Top 0.406: IC3.16 115.57,89.27 v115.57,82.55
  Top 0.61: v72.39,82.55 SV1.9
  Bottom 0.61: v115.57,82.55 v72.39,82.55
MOSI  (via drill 0.45)
  Top 0.406: IC3.15 113.03,90.53 113.03,89.85 114.3,88.58 v114.3,83.82
  Top 0.61: v62.23,83.82 SV1.1
  Bottom 0.61: v114.3,83.82 v62.23,83.82
N$1
  Bottom 0.813: K1.2 D2.A 208.28,91.44 T1.C
N$2  (via drill 0.45)
  Top 0.406: IC3.30 118.43,100.46 v118.43,102.87
  Bottom 0.406: J1.1 137.15,102.86 135.63,102.86 134.91,102.13 132.52,102.13 131.78,102.87 v118.43,102.87
N$3
  Top 1.27: IC2.2 12.7,98.37 12.7,91.44 D1.C 19.01,91.44 L1.1
N$4
  Top 0.61: R4.2 205.74,88.9 T1.B
N$5
  Top 1.27: R3.1 233.68,104.14 237.49,100.33 OK1.2
N$6  (via drill 0.45)
  Top 0.406: IC3.31 117.47,100.64 v117.47,104.14
  Bottom 0.406: v117.47,104.14 131.54,104.14 132.82,102.86 134.61,102.86 J1.2
N$7  (via drill 0.45)
  Top 0.61: M4:IC21.10 169.54,69.22 170.18,68.58 171.45,68.58 172.72,69.85 v172.72,72.39 | M5:IC21.9 v220.34,72.39
  Bottom 0.61: v220.34,72.39 v172.72,72.39
N$8  (via drill 0.45)
  Top 0.61: M1:IC11.9 v45.09,76.2 | M2:IC11.14 v88.27,76.2
  Bottom 0.61: v45.09,76.2 v88.27,76.2
N$9
  Top 0.406: IC3.8 108.08,94.48 Q1.2 101.05,94.48 C3.1
N$10
  Top 0.406: IC3.7 108.78,99.31 Q1.1 101.05,99.31 C2.1 | C2.1
N$11  (via drill 0.45)
  Top 0.406: IC3.20 118.9,91.44 118.9,90.65 v119.38,90.17
  Bottom 0.61: v119.38,90.17 C1.1
N$12  (via drill 0.45)
  Top 0.61: M3:IC21.10 120.02,69.22 120.65,68.58 121.92,68.58 123.19,69.85 v123.19,72.39 | M4:IC21.9 v170.81,72.39
  Bottom 0.61: v170.81,72.39 v123.19,72.39
N$13  (via drill 0.45)
  Top 0.61: M2:IC21.10 70.48,69.22 71.12,68.58 72.39,68.58 73.66,69.85 v73.66,72.39 | M3:IC21.9 v121.28,72.39
  Bottom 0.61: v121.28,72.39 v73.66,72.39
N$14  (via drill 0.45)
  Top 0.61: M2:IC11.9 v94.61,76.2 | M3:IC11.14 v137.79,76.2
  Bottom 0.61: v94.61,76.2 v137.79,76.2
N$15  (via drill 0.45)
  Top 0.61: M1:IC21.10 v20.95,72.39 | v71.75,72.39 M2:IC21.9
  Bottom 0.61: v20.95,72.39 v71.75,72.39
N$18
  Bottom 3.048: K1.S1 245.19,91.44 X3.1
N$20  (via drill 0.45)
  Top 0.61: M3:IC11.9 v144.15,76.2 | M4:IC11.14 v187.32,76.2
  Bottom 0.61: v144.15,76.2 v187.32,76.2
N$26  (via drill 0.45)
  Top 0.61: M4:IC11.9 v193.68,76.2 | M5:IC11.14 v236.85,76.2
  Bottom 0.61: v193.68,76.2 v236.85,76.2
N$40
  Bottom 3.048: K1.O1 233.45,87.63 240.35,87.63 245.35,82.63 X3.3
N$46
  Top 3.048: K1.P1 238.43,87.63 X3.2
O_CLK  (via drill 0.45)
  Top 0.406: v111.28,103.35 111.52,103.35 IC3.1 | v93.98,100.33 v93.98,78.74
  Top 0.61: M2:IC11.11 v92.08,78.74 | M1:IC11.11 v42.55,78.74 | M3:IC11.11 v141.6,78.74 | M4:IC11.11 v191.13,78.74 | M5:IC11.11 v240.66,78.74
  Bottom 0.406: v111.28,103.35 98.27,103.35 95.25,100.33 v93.98,100.33
  Bottom 0.61: v42.55,78.74 v92.08,78.74 v93.98,78.74 v141.6,78.74 v191.13,78.74 v240.66,78.74
O_LATCH  (via drill 0.45)
  Top 0.406: 111.5,102.23 111.12,102.23 v111.12,102.17 | v95.25,99.06 v95.25,77.47 | IC3.2 111.5,102.23 | 111.5,102.23
  Top 0.61: M1:IC11.12 v41.27,77.47 | v239.4,77.47 M5:IC11.12 | M2:IC11.12 v90.81,77.47 | M3:IC11.12 v140.34,77.47 | M4:IC11.12 v189.87,77.47
  Bottom 0.406: v111.12,102.17 110.9,102.4 110.89,102.4 110.74,102.55 98.74,102.55 v95.25,99.06
  Bottom 0.61: v41.27,77.47 v90.81,77.47 v95.25,77.47 v140.34,77.47 v189.87,77.47 v239.4,77.47
O_SERIN  (via drill 0.45)
  Top 0.406: IC3.32 112.84,104.14 v112.55,104.14 | v92.71,101.6 v92.71,80.01
  Top 0.61: M1:IC11.14 v38.73,80.01
  Bottom 0.406: v112.55,104.14 111.83,104.14 111.68,104.3 110.89,104.3 110.74,104.14 97.79,104.14 95.25,101.6 v92.71,101.6 | v92.71,80.01 v38.73,80.01
SCK  (via drill 0.45)
  Top 0.406: IC3.17 116.84,90.11 v116.84,81.28
  Top 0.61: v69.85,82.55 SV1.7
  Bottom 0.61: v69.85,82.55 71.12,81.28 v116.84,81.28